# Altium project RK3128_BETA_V03_20151231.PrjPcb (part 1 of 3)
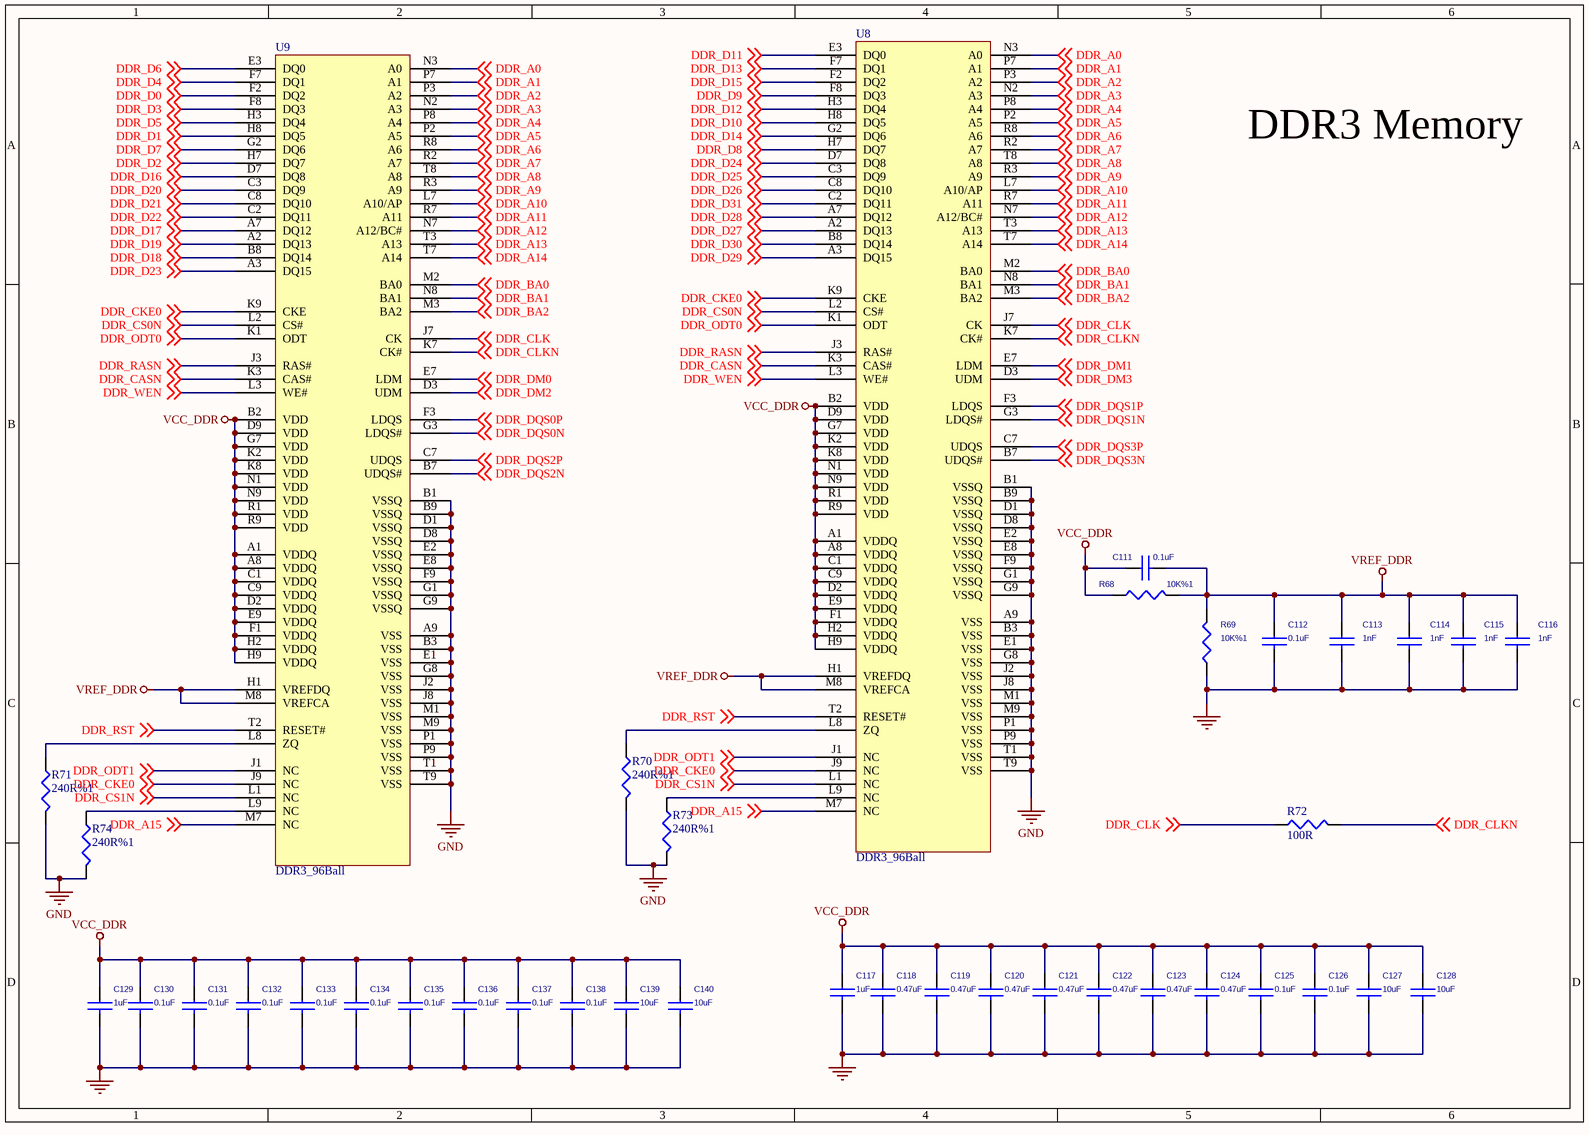
[diagram p0: Option_DDR3_96ball.SchDoc]
28 sheets, 530 parts. Net scope: global (net labels, ports and power ports of the same name join across sheets).
Sheets:
  Option_DDR3_96ball.SchDoc
  Option_Nand_Flash.SchDoc
  Option_LPDDR2-32_168_BGA134.SchDoc
  Option_lcd.SchDoc
  Option_PMIC_RK816.SchDoc
  Option_CTP.SchDoc
  Option_camera.SchDoc
  Option_Audio.SchDoc
  Option_key.SchDoc
  Option_AP6xxx.SchDoc
  Option_PMIC_RK808.SchDoc
  Option_Charger.SchDoc
  Option_LighterSensor.SchDoc
  Option_Humidity_Tempture_Sensor.SchDoc
  Option_MotionSensor.SchDoc
  Option_PMIC_RK818.SchDoc
  11_RK3128_CODEC_HDMI_DAC.SchDoc
  10_RK3128_misc.SchDoc
  09_Rk3128_lcd_cif.SchDoc
  08_RK3128_Flash_SDMMC.SchDoc
  07_RK3128_DDR.SchDoc
  06_RK3128_USB_ADC_Crystal.SchDoc
  05_RK3128_VDD.SchDoc
  04_Power_Diagram_rk816.SchDoc
  04_Power_Diagram.SchDoc
  03_Peripherals.SchDoc
  02_modify_note.SchDoc
  01_index.SchDoc

## Sheet Option_DDR3_96ball.SchDoc
size 297 x 209 mm

### Parts
C111  0.1uF  [C0402]
C112  0.1uF  [C0402]
C113  1nF  [C0402]
C114  1nF  [C0402]
C115  1nF  [C0402]
C116  1nF  [C0402]
C117  1uF  [C0402]
C118  0.47uF  [C0402]
C119  0.47uF  [C0402]
C120  0.47uF  [C0402]
C121  0.47uF  [C0402]
C122  0.47uF  [C0402]
C123  0.47uF  [C0402]
C124  0.47uF  [C0402]
C125  0.1uF  [C0402]
C126  0.1uF  [C0402]
C127  10uF  [C0805]
C128  10uF  [C0805]
C129  1uF  [C0402]
C130  0.1uF  [C0402]
C131  0.1uF  [C0402]
C132  0.1uF  [C0402]
C133  0.1uF  [C0402]
C134  0.1uF  [C0402]
C135  0.1uF  [C0402]
C136  0.1uF  [C0402]
C137  0.1uF  [C0402]
C138  0.1uF  [C0402]
C139  10uF  [C0805]
C140  10uF  [C0805]
R68  10K%1  [R0402]
R69  10K%1  [R0402]
R70  240R%1  [R0402]
R71  240R%1  [R0402]
R72  100R  [R0402]
R73  240R%1  [R0402]
R74  240R%1  [R0402]
U8  DDR3_96Ball
U9  DDR3_96Ball

### Nets
GND: C112.2 C113.2 C114.2 C115.2 C116.2 C117.2 C118.2 C119.2 C120.2 C121.2 C122.2 C123.2 C124.2 C125.2 C126.2 C127.2 C128.2 C129.2 C130.2 C131.2 C132.2 C133.2 C134.2 C135.2 C136.2 C137.2 C138.2 C139.2 C140.2 R69.1 R70.2 R71.2 R73.2 R74.2 U8.A9(VSS) U8.B1(VSSQ) U8.B3(VSS) U8.B9(VSSQ) U8.D1(VSSQ) U8.D8(VSSQ) U8.E1(VSS) U8.E2(VSSQ) U8.E8(VSSQ) U8.F9(VSSQ) U8.G1(VSSQ) U8.G8(VSS) U8.G9(VSSQ) U8.J2(VSS) U8.J8(VSS) U8.M1(VSS) U8.M9(VSS) U8.P1(VSS) U8.P9(VSS) U8.T1(VSS) U8.T9(VSS) U9.A9(VSS) U9.B1(VSSQ) U9.B3(VSS) U9.B9(VSSQ) U9.D1(VSSQ) U9.D8(VSSQ) U9.E1(VSS) U9.E2(VSSQ) U9.E8(VSSQ) U9.F9(VSSQ) U9.G1(VSSQ) U9.G8(VSS) U9.G9(VSSQ) U9.J2(VSS) U9.J8(VSS) U9.M1(VSS) U9.M9(VSS) U9.P1(VSS) U9.P9(VSS) U9.T1(VSS) U9.T9(VSS)
VCC_DDR: C111.1 C117.1 C118.1 C119.1 C120.1 C121.1 C122.1 C123.1 C124.1 C125.1 C126.1 C127.1 C128.1 C129.1 C130.1 C131.1 C132.1 C133.1 C134.1 C135.1 C136.1 C137.1 C138.1 C139.1 C140.1 R68.1 U8.A1(VDDQ) U8.A8(VDDQ) U8.B2(VDD) U8.C1(VDDQ) U8.C9(VDDQ) U8.D2(VDDQ) U8.D9(VDD) U8.E9(VDDQ) U8.F1(VDDQ) U8.G7(VDD) U8.H2(VDDQ) U8.H9(VDDQ) U8.K2(VDD) U8.K8(VDD) U8.N1(VDD) U8.N9(VDD) U8.R1(VDD) U8.R9(VDD) U9.A1(VDDQ) U9.A8(VDDQ) U9.B2(VDD) U9.C1(VDDQ) U9.C9(VDDQ) U9.D2(VDDQ) U9.D9(VDD) U9.E9(VDDQ) U9.F1(VDDQ) U9.G7(VDD) U9.H2(VDDQ) U9.H9(VDDQ) U9.K2(VDD) U9.K8(VDD) U9.N1(VDD) U9.N9(VDD) U9.R1(VDD) U9.R9(VDD)
VREF_DDR: C111.2 C112.1 C113.1 C114.1 C115.1 C116.1 R68.2 R69.2 U8.H1(VREFDQ) U8.M8(VREFCA) U9.H1(VREFDQ) U9.M8(VREFCA)
DDR_A0: U8.N3(A0) U9.N3(A0) ; off-sheet DDR_A0
DDR_A1: U8.P7(A1) U9.P7(A1) ; off-sheet DDR_A1
DDR_A2: U8.P3(A2) U9.P3(A2) ; off-sheet DDR_A2
DDR_A3: U8.N2(A3) U9.N2(A3) ; off-sheet DDR_A3
DDR_A4: U8.P8(A4) U9.P8(A4) ; off-sheet DDR_A4
DDR_A5: U8.P2(A5) U9.P2(A5) ; off-sheet DDR_A5
DDR_A6: U8.R8(A6) U9.R8(A6) ; off-sheet DDR_A6
DDR_A7: U8.R2(A7) U9.R2(A7) ; off-sheet DDR_A7
DDR_A8: U8.T8(A8) U9.T8(A8) ; off-sheet DDR_A8
DDR_A9: U8.R3(A9) U9.R3(A9) ; off-sheet DDR_A9
DDR_A10: U8.L7(A10/AP) U9.L7(A10/AP) ; off-sheet DDR_A10
DDR_A11: U8.R7(A11) U9.R7(A11) ; off-sheet DDR_A11
DDR_A12: U8.N7(A12/BC#) U9.N7(A12/BC#) ; off-sheet DDR_A12
DDR_A13: U8.T3(A13) U9.T3(A13) ; off-sheet DDR_A13
DDR_A14: U8.T7(A14) U9.T7(A14) ; off-sheet DDR_A14
DDR_A15: U8.M7(NC) U9.M7(NC) ; off-sheet DDR_A15
DDR_BA0: U8.M2(BA0) U9.M2(BA0) ; off-sheet DDR_BA0
DDR_BA1: U8.N8(BA1) U9.N8(BA1) ; off-sheet DDR_BA1
DDR_BA2: U8.M3(BA2) U9.M3(BA2) ; off-sheet DDR_BA2
DDR_CASN: U8.K3(CAS#) U9.K3(CAS#) ; off-sheet DDR_CASN
DDR_CKE0: U8.J9(NC) U8.K9(CKE) U9.J9(NC) U9.K9(CKE) ; off-sheet DDR_CKE0
DDR_CLK: R72.1 U8.J7(CK) U9.J7(CK) ; off-sheet DDR_CLK
DDR_CLKN: R72.2 U8.K7(CK#) U9.K7(CK#) ; off-sheet DDR_CLKN
DDR_CS0N: U8.L2(CS#) U9.L2(CS#) ; off-sheet DDR_CS0N
DDR_CS1N: U8.L1(NC) U9.L1(NC) ; off-sheet DDR_CS1N
DDR_D0: U9.F2(DQ2) ; off-sheet DDR_D0
DDR_D1: U9.H8(DQ5) ; off-sheet DDR_D1
DDR_D2: U9.H7(DQ7) ; off-sheet DDR_D2
DDR_D3: U9.F8(DQ3) ; off-sheet DDR_D3
DDR_D4: U9.F7(DQ1) ; off-sheet DDR_D4
DDR_D5: U9.H3(DQ4) ; off-sheet DDR_D5
DDR_D6: U9.E3(DQ0) ; off-sheet DDR_D6
DDR_D7: U9.G2(DQ6) ; off-sheet DDR_D7
DDR_D8: U8.H7(DQ7) ; off-sheet DDR_D8
DDR_D9: U8.F8(DQ3) ; off-sheet DDR_D9
DDR_D10: U8.H8(DQ5) ; off-sheet DDR_D10
DDR_D11: U8.E3(DQ0) ; off-sheet DDR_D11
DDR_D12: U8.H3(DQ4) ; off-sheet DDR_D12
DDR_D13: U8.F7(DQ1) ; off-sheet DDR_D13
DDR_D14: U8.G2(DQ6) ; off-sheet DDR_D14
DDR_D15: U8.F2(DQ2) ; off-sheet DDR_D15
DDR_D16: U9.D7(DQ8) ; off-sheet DDR_D16
DDR_D17: U9.A7(DQ12) ; off-sheet DDR_D17
DDR_D18: U9.B8(DQ14) ; off-sheet DDR_D18
DDR_D19: U9.A2(DQ13) ; off-sheet DDR_D19
DDR_D20: U9.C3(DQ9) ; off-sheet DDR_D20
DDR_D21: U9.C8(DQ10) ; off-sheet DDR_D21
DDR_D22: U9.C2(DQ11) ; off-sheet DDR_D22
DDR_D23: U9.A3(DQ15) ; off-sheet DDR_D23
DDR_D24: U8.D7(DQ8) ; off-sheet DDR_D24
DDR_D25: U8.C3(DQ9) ; off-sheet DDR_D25
DDR_D26: U8.C8(DQ10) ; off-sheet DDR_D26
DDR_D27: U8.A2(DQ13) ; off-sheet DDR_D27
DDR_D28: U8.A7(DQ12) ; off-sheet DDR_D28
DDR_D29: U8.A3(DQ15) ; off-sheet DDR_D29
DDR_D30: U8.B8(DQ14) ; off-sheet DDR_D30
DDR_D31: U8.C2(DQ11) ; off-sheet DDR_D31
DDR_DM0: U9.E7(LDM) ; off-sheet DDR_DM0
DDR_DM1: U8.E7(LDM) ; off-sheet DDR_DM1
DDR_DM2: U9.D3(UDM) ; off-sheet DDR_DM2
DDR_DM3: U8.D3(UDM) ; off-sheet DDR_DM3
DDR_DQS0N: U9.G3(LDQS#) ; off-sheet DDR_DQS0N
DDR_DQS0P: U9.F3(LDQS) ; off-sheet DDR_DQS0P
DDR_DQS1N: U8.G3(LDQS#) ; off-sheet DDR_DQS1N
DDR_DQS1P: U8.F3(LDQS) ; off-sheet DDR_DQS1P
DDR_DQS2N: U9.B7(UDQS#) ; off-sheet DDR_DQS2N
DDR_DQS2P: U9.C7(UDQS) ; off-sheet DDR_DQS2P
DDR_DQS3N: U8.B7(UDQS#) ; off-sheet DDR_DQS3N
DDR_DQS3P: U8.C7(UDQS) ; off-sheet DDR_DQS3P
DDR_ODT0: U8.K1(ODT) U9.K1(ODT) ; off-sheet DDR_ODT0
DDR_ODT1: U8.J1(NC) U9.J1(NC) ; off-sheet DDR_ODT1
DDR_RASN: U8.J3(RAS#) U9.J3(RAS#) ; off-sheet DDR_RASN
DDR_RST: U8.T2(RESET#) U9.T2(RESET#) ; off-sheet DDR_RST
DDR_WEN: U8.L3(WE#) U9.L3(WE#) ; off-sheet DDR_WEN
NetR70_1: R70.1 U8.L8(ZQ)
NetR71_1: R71.1 U9.L8(ZQ)
NetR73_1: R73.1 U8.L9(NC)
NetR74_1: R74.1 U9.L9(NC)

### Notes on the sheet
- DDR3 Memory

### Library data of the parts
C111-C116 = CAP NP_0
C117-C124 C129 C130 = CAP NP: RoHS CHIP CAP 1uF +10/-10% X5R
C125-C128 C131-C140 = CAP NP: RoHS CHIP CAP 0.1uF +10/-10% X7R
R68 R69 = RESISTOR_0: 贴片电阻
R70-R74 = RESISTOR

## Sheet Option_Nand_Flash.SchDoc
size 297 x 209 mm
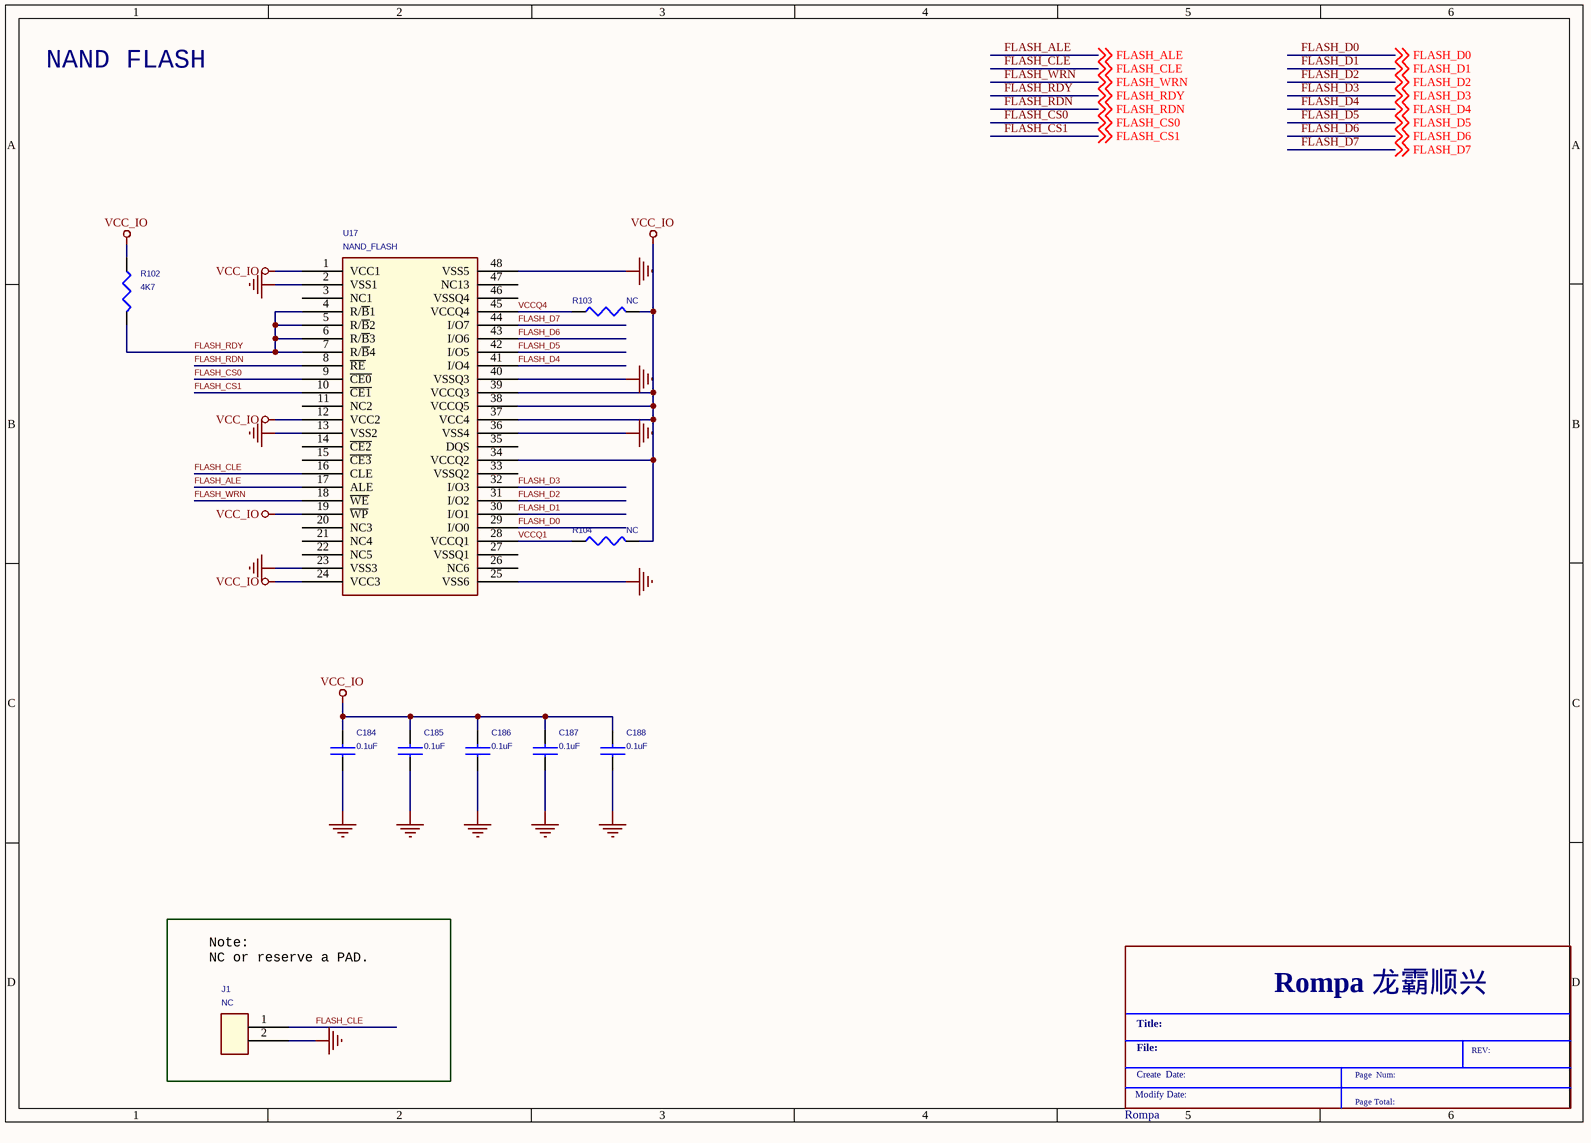
[diagram p1: Option_Nand_Flash.SchDoc]

### Parts
(Parts that share a designator on the sheet are numbered #1, #2 ... from top to bottom, then left to right.)
*#1  Rompa  (graphical)
C184  0.1uF  [C0402]
C185  0.1uF  [C0402]
C186  0.1uF  [C0402]
C187  0.1uF  [C0402]
C188  0.1uF  [C0402]
J1  NC  [R0603]
R102  4K7  [R0402]
R103  NC  [R0402]
R104  NC  [R0402]
U17  NAND_FLASH  [TSOP1-48]

### Nets
GND: C184.1 C185.1 C186.1 C187.1 C188.1 J1.2 U17.2(VSS1) U17.13(VSS2) U17.23(VSS3) U17.25(VSS6) U17.36(VSS4) U17.40(VSSQ3) U17.48(VSS5)
VCC_IO: C184.2 C185.2 C186.2 C187.2 C188.2 R102.1 R103.2 R104.2 U17.1(VCC1) U17.12(VCC2) U17.19(~{WP}) U17.24(VCC3) U17.34(VCCQ2) U17.37(VCC4) U17.38(VCCQ5) U17.39(VCCQ3)
FLASH_ALE: U17.17(ALE) ; off-sheet FLASH_ALE
FLASH_CLE: J1.1 U17.16(CLE) ; off-sheet FLASH_CLE
FLASH_CS0: U17.9(~{CE0}) ; off-sheet FLASH_CS0
FLASH_CS1: U17.10(~{CE1}) ; off-sheet FLASH_CS1
FLASH_D0: U17.29(I/O0) ; off-sheet FLASH_D0
FLASH_D1: U17.30(I/O1) ; off-sheet FLASH_D1
FLASH_D2: U17.31(I/O2) ; off-sheet FLASH_D2
FLASH_D3: U17.32(I/O3) ; off-sheet FLASH_D3
FLASH_D4: U17.41(I/O4) ; off-sheet FLASH_D4
FLASH_D5: U17.42(I/O5) ; off-sheet FLASH_D5
FLASH_D6: U17.43(I/O6) ; off-sheet FLASH_D6
FLASH_D7: U17.44(I/O7) ; off-sheet FLASH_D7
FLASH_RDN: U17.8(~{RE}) ; off-sheet FLASH_RDN
FLASH_RDY: R102.2 U17.4(R/~{B}1) U17.5(R/~{B}2) U17.6(R/~{B}3) U17.7(R/~{B}4) ; off-sheet FLASH_RDY
FLASH_WRN: U17.18(~{WE}) ; off-sheet FLASH_WRN
VCCQ1: R104.1 U17.28(VCCQ1)
VCCQ4: R103.1 U17.45(VCCQ4)

Not connected (* = marked no-connect by the designer): U17 3(NC1) 11(NC2) 14(~{CE2}) 15(~{CE3}) 20(NC3) 21(NC4) 22(NC5) 26(NC6) 27(VSSQ1) 33(VSSQ2) 35(DQS) 46(VSSQ4) 47(NC13)

### Notes on the sheet
- NAND FLASH
- (near J1) Note:
  NC or reserve a PAD.
- (in symbol Rompa) Rompa 龙霸顺兴; Title:; File:; REV:; Create  Date:; Page  Num:; Modify Date:; Page Total:

### Library data of the parts
C184-C188 = CAP NP: RoHS CHIP CAP 0.1uF +10/-10% X7R
J1 = CON2: TEST
R102-R104 = RES 1B: ROHS CHIP RES 4.7K 1/16W 5%
U17 = NANDFLASH_0: NAND Flash,2.7V,3.3V,3.6V,2G*8,N/A,-40℃~85℃,TSOP-48P

## Sheet Option_LPDDR2-32_168_BGA134.SchDoc
size 420 x 297 mm
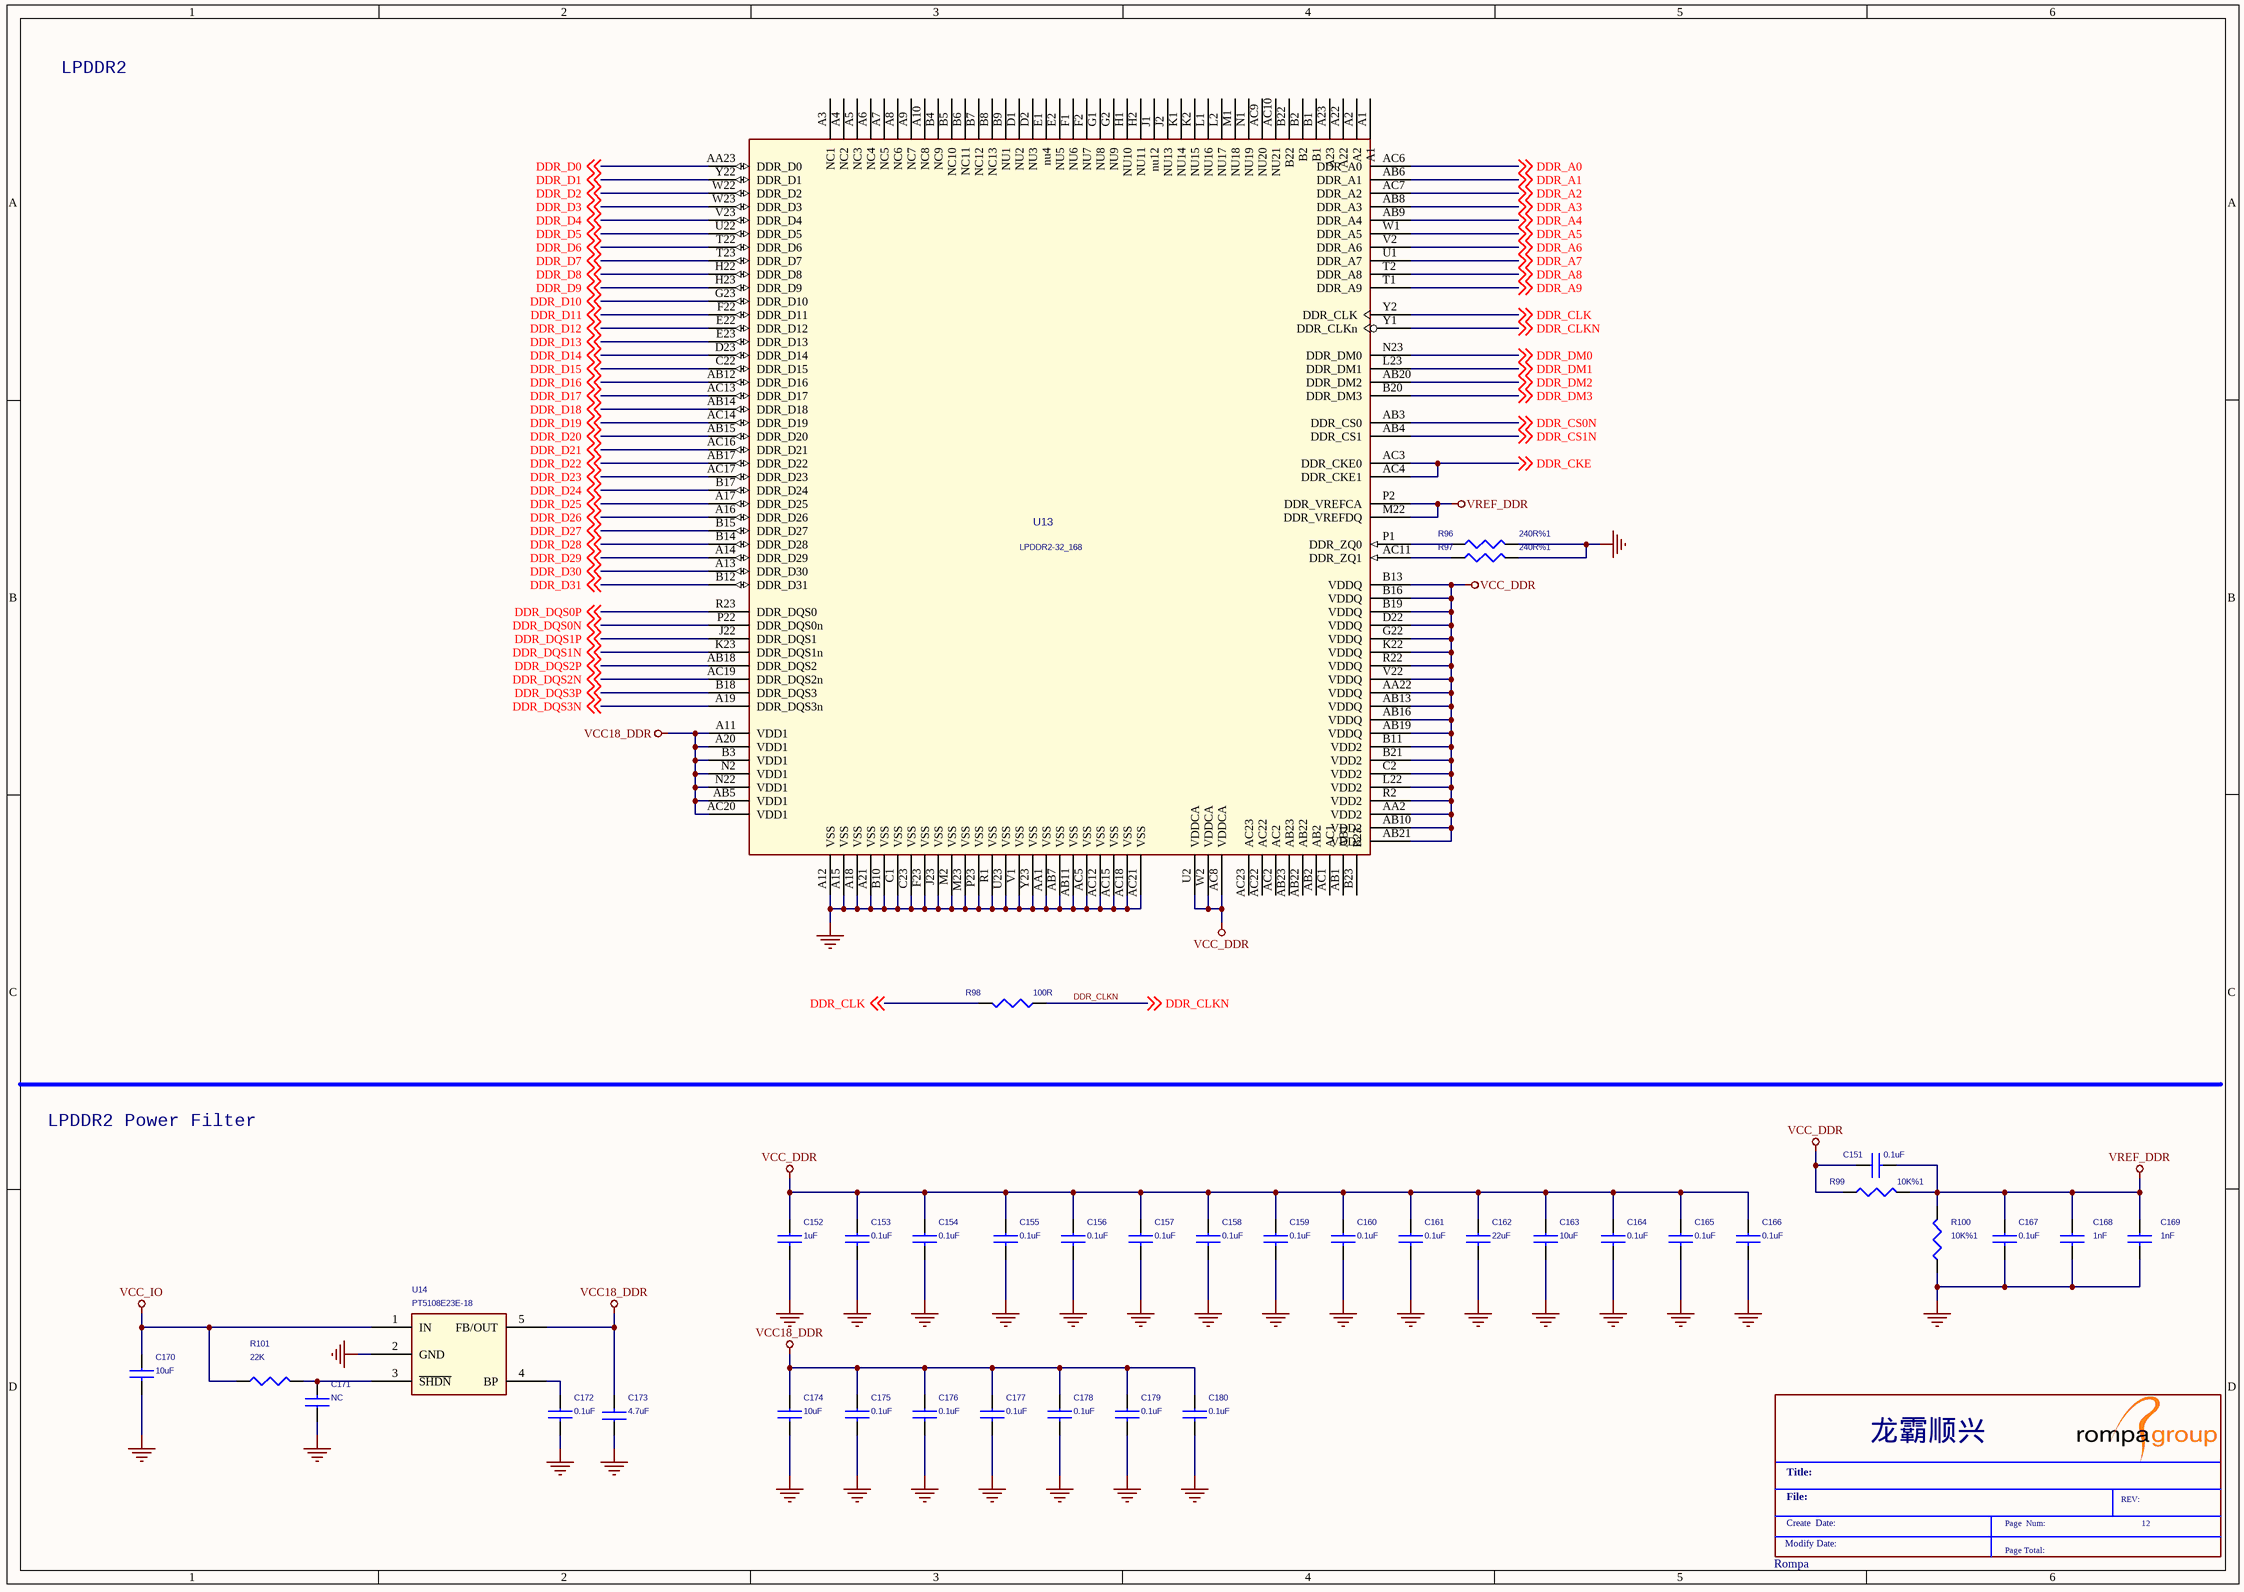
[diagram p2: Option_LPDDR2-32_168_BGA134.SchDoc]

### Parts
(Parts that share a designator on the sheet are numbered #1, #2 ... from top to bottom, then left to right.)
*#2  Rompa  Schematic Page Number: 12  (graphical)
C151  0.1uF  [C0402]
C152  1uF  [C0402]
C153  0.1uF  [C0402]
C154  0.1uF  [C0402]
C155  0.1uF  [C0402]
C156  0.1uF  [C0402]
C157  0.1uF  [C0402]
C158  0.1uF  [C0402]
C159  0.1uF  [C0402]
C160  0.1uF  [C0402]
C161  0.1uF  [C0402]
C162  22uF  [C0402]
C163  10uF  [C0402]
C164  0.1uF  [C0402]
C165  0.1uF  [C0402]
C166  0.1uF  [C0402]
C167  0.1uF  [C0402]
C168  1nF  [C0402]
C169  1nF  [C0402]
C170  10uF  [C0402]
C171  NC  [C0402]
C172  0.1uF  [C0402]
C173  4.7uF  [C0402]
C174  10uF  [C0402]
C175  0.1uF  [C0402]
C176  0.1uF  [C0402]
C177  0.1uF  [C0402]
C178  0.1uF  [C0402]
C179  0.1uF  [C0402]
C180  0.1uF  [C0402]
R96  240R%1  [R0402]
R97  240R%1  [R0402]
R98  100R  [R0402]
R99  10K%1  [R0402]
R100  10K%1  [R0402]
R101  22K  [R0402]
U13  LPDDR2-32_168  [BGA134]
U14  PT5108E23E-18  [SOT25]

### Nets
GND: C152.2 C153.2 C154.2 C155.2 C156.2 C157.2 C158.2 C159.2 C160.2 C161.2 C162.2 C163.2 C164.2 C165.2 C166.2 C167.2 C168.2 C169.2 C170.2 C171.1 C172.2 C173.1 C174.2 C175.2 C176.2 C177.2 C178.2 C179.2 C180.2 R96.2 R97.2 R100.1 U13.A12(VSS) U13.A15(VSS) U13.A18(VSS) U13.A21(VSS) U13.AA1(VSS) U13.AB7(VSS) U13.AB11(VSS) U13.AC5(VSS) U13.AC12(VSS) U13.AC15(VSS) U13.AC18(VSS) U13.AC21(VSS) U13.B10(VSS) U13.C1(VSS) U13.C23(VSS) U13.F23(VSS) U13.J23(VSS) U13.M2(VSS) U13.M23(VSS) U13.P23(VSS) U13.R1(VSS) U13.U23(VSS) U13.V1(VSS) U13.Y23(VSS) U14.2(GND)
VCC18_DDR: C173.2 C174.1 C175.1 C176.1 C177.1 C178.1 C179.1 C180.1 U13.A11(VDD1) U13.A20(VDD1) U13.AB5(VDD1) U13.AC20(VDD1) U13.B3(VDD1) U13.N2(VDD1) U13.N22(VDD1) U14.5(FB/OUT)
VCC_DDR: C151.1 C152.1 C153.1 C154.1 C155.1 C156.1 C157.1 C158.1 C159.1 C160.1 C161.1 C162.1 C163.1 C164.1 C165.1 C166.1 R99.1 U13.AA2(VDD2) U13.AA22(VDDQ) U13.AB10(VDD2) U13.AB13(VDDQ) U13.AB16(VDDQ) U13.AB19(VDDQ) U13.AB21(VDD2) U13.AC8(VDDCA) U13.B11(VDD2) U13.B13(VDDQ) U13.B16(VDDQ) U13.B19(VDDQ) U13.B21(VDD2) U13.C2(VDD2) U13.D22(VDDQ) U13.G22(VDDQ) U13.K22(VDDQ) U13.L22(VDD2) U13.R2(VDD2) U13.R22(VDDQ) U13.U2(VDDCA) U13.V22(VDDQ) U13.W2(VDDCA)
VCC_IO: C170.1 R101.1 U14.1(IN)
VREF_DDR: C151.2 C167.1 C168.1 C169.1 R99.2 R100.2 U13.M22(DDR_VREFDQ) U13.P2(DDR_VREFCA)
DDR_A0: U13.AC6(DDR_A0) ; off-sheet DDR_A0
DDR_A1: U13.AB6(DDR_A1) ; off-sheet DDR_A1
DDR_A2: U13.AC7(DDR_A2) ; off-sheet DDR_A2
DDR_A3: U13.AB8(DDR_A3) ; off-sheet DDR_A3
DDR_A4: U13.AB9(DDR_A4) ; off-sheet DDR_A4
DDR_A5: U13.W1(DDR_A5) ; off-sheet DDR_A5
DDR_A6: U13.V2(DDR_A6) ; off-sheet DDR_A6
DDR_A7: U13.U1(DDR_A7) ; off-sheet DDR_A7
DDR_A8: U13.T2(DDR_A8) ; off-sheet DDR_A8
DDR_A9: U13.T1(DDR_A9) ; off-sheet DDR_A9
DDR_CKE: U13.AC3(DDR_CKE0) U13.AC4(DDR_CKE1) ; off-sheet DDR_CKE
DDR_CLK: R98.2 U13.Y2(DDR_CLK) ; off-sheet DDR_CLK
DDR_CLKN: R98.1 U13.Y1(DDR_CLKn) ; off-sheet DDR_CLKN
DDR_CS0N: U13.AB3(DDR_CS0) ; off-sheet DDR_CS0N
DDR_CS1N: U13.AB4(DDR_CS1) ; off-sheet DDR_CS1N
DDR_D0: U13.AA23(DDR_D0) ; off-sheet DDR_D0
DDR_D1: U13.Y22(DDR_D1) ; off-sheet DDR_D1
DDR_D2: U13.W22(DDR_D2) ; off-sheet DDR_D2
DDR_D3: U13.W23(DDR_D3) ; off-sheet DDR_D3
DDR_D4: U13.V23(DDR_D4) ; off-sheet DDR_D4
DDR_D5: U13.U22(DDR_D5) ; off-sheet DDR_D5
DDR_D6: U13.T22(DDR_D6) ; off-sheet DDR_D6
DDR_D7: U13.T23(DDR_D7) ; off-sheet DDR_D7
DDR_D8: U13.H22(DDR_D8) ; off-sheet DDR_D8
DDR_D9: U13.H23(DDR_D9) ; off-sheet DDR_D9
DDR_D10: U13.G23(DDR_D10) ; off-sheet DDR_D10
DDR_D11: U13.F22(DDR_D11) ; off-sheet DDR_D11
DDR_D12: U13.E22(DDR_D12) ; off-sheet DDR_D12
DDR_D13: U13.E23(DDR_D13) ; off-sheet DDR_D13
DDR_D14: U13.D23(DDR_D14) ; off-sheet DDR_D14
DDR_D15: U13.C22(DDR_D15) ; off-sheet DDR_D15
DDR_D16: U13.AB12(DDR_D16) ; off-sheet DDR_D16
DDR_D17: U13.AC13(DDR_D17) ; off-sheet DDR_D17
DDR_D18: U13.AB14(DDR_D18) ; off-sheet DDR_D18
DDR_D19: U13.AC14(DDR_D19) ; off-sheet DDR_D19
DDR_D20: U13.AB15(DDR_D20) ; off-sheet DDR_D20
DDR_D21: U13.AC16(DDR_D21) ; off-sheet DDR_D21
DDR_D22: U13.AB17(DDR_D22) ; off-sheet DDR_D22
DDR_D23: U13.AC17(DDR_D23) ; off-sheet DDR_D23
DDR_D24: U13.B17(DDR_D24) ; off-sheet DDR_D24
DDR_D25: U13.A17(DDR_D25) ; off-sheet DDR_D25
DDR_D26: U13.A16(DDR_D26) ; off-sheet DDR_D26
DDR_D27: U13.B15(DDR_D27) ; off-sheet DDR_D27
DDR_D28: U13.B14(DDR_D28) ; off-sheet DDR_D28
DDR_D29: U13.A14(DDR_D29) ; off-sheet DDR_D29
DDR_D30: U13.A13(DDR_D30) ; off-sheet DDR_D30
DDR_D31: U13.B12(DDR_D31) ; off-sheet DDR_D31
DDR_DM0: U13.N23(DDR_DM0) ; off-sheet DDR_DM0
DDR_DM1: U13.L23(DDR_DM1) ; off-sheet DDR_DM1
DDR_DM2: U13.AB20(DDR_DM2) ; off-sheet DDR_DM2
DDR_DM3: U13.B20(DDR_DM3) ; off-sheet DDR_DM3
DDR_DQS0N: U13.P22(DDR_DQS0n) ; off-sheet DDR_DQS0N
DDR_DQS0P: U13.R23(DDR_DQS0) ; off-sheet DDR_DQS0P
DDR_DQS1N: U13.K23(DDR_DQS1n) ; off-sheet DDR_DQS1N
DDR_DQS1P: U13.J22(DDR_DQS1) ; off-sheet DDR_DQS1P
DDR_DQS2N: U13.AC19(DDR_DQS2n) ; off-sheet DDR_DQS2N
DDR_DQS2P: U13.AB18(DDR_DQS2) ; off-sheet DDR_DQS2P
DDR_DQS3N: U13.A19(DDR_DQS3n) ; off-sheet DDR_DQS3N
DDR_DQS3P: U13.B18(DDR_DQS3) ; off-sheet DDR_DQS3P
NetC171_2: C171.2 R101.2 U14.3(~{SHDN})
NetC172_1: C172.1 U14.4(BP)
NetR96_1: R96.1 U13.P1(DDR_ZQ0)
NetR97_1: R97.1 U13.AC11(DDR_ZQ1)

Not connected (* = marked no-connect by the designer): U13 A1 A2 A3(NC1) A4(NC2) A5(NC3) A6(NC4) A7(NC5) A8(NC6) A9(NC7) A10(NC8) A22 A23 AB1 AB2 AB22 AB23 AC1 AC2 AC9(NU20) AC10(NU21) AC22 AC23 B1 B2 B4(NC9) B5(NC10) B6(NC11) B7(NC12) B8(NC13) B9(NU1) B22 B23 D1(NU2) D2(NU3) E1(nu4) E2(NU5) F1(NU6) F2(NU7) G1(NU8) G2(NU9) H1(NU10) H2(NU11) J1(nu12) J2(NU13) K1(NU14) K2(NU15) L1(NU16) L2(NU17) M1(NU18) N1(NU19)

### Notes on the sheet
- LPDDR2
- LPDDR2 Power Filter
- (in symbol Rompa) 龙霸顺兴; Title:; File:; REV:; Create  Date:; Page  Num:; Modify Date:; Page Total:

### Library data of the parts
C151 C167-C169 = CAP NP_0
C152 C153 C174 = CAP NP: RoHS CHIP CAP 1uF +10/-10% X5R
C154-C166 C175-C180 = CAP NP: RoHS CHIP CAP 0.1uF +10/-10% X7R
C170 = CAP NP: CAP,MLCC,22uF,+/-10%,X5R,6.3V,SMD1206
C171 = CAP NP
C172 = CAP NP: CAP,MLCC,100nF,+/-10%,X7R,6.3V,SMD0402
C173 = CAP NP: CAP,MLCC,10uF,+/-10%,X5R,6.3V,SMD0805
R96 R97 R99 R100 = RESISTOR_0: 贴片电阻
R98 = RESISTOR: NC/ROHS CHIP RES 100R 1/16W 5%
R101 = RES 1B
U13 = LPDDR2-32_2
U14 = DS8008_4: LDO,PT5108E23E-18,VINmax=5.5V,Vout=1.8V,+/-2%,500mA,SOT-23-5

## Sheet Option_lcd.SchDoc
size 297 x 209 mm
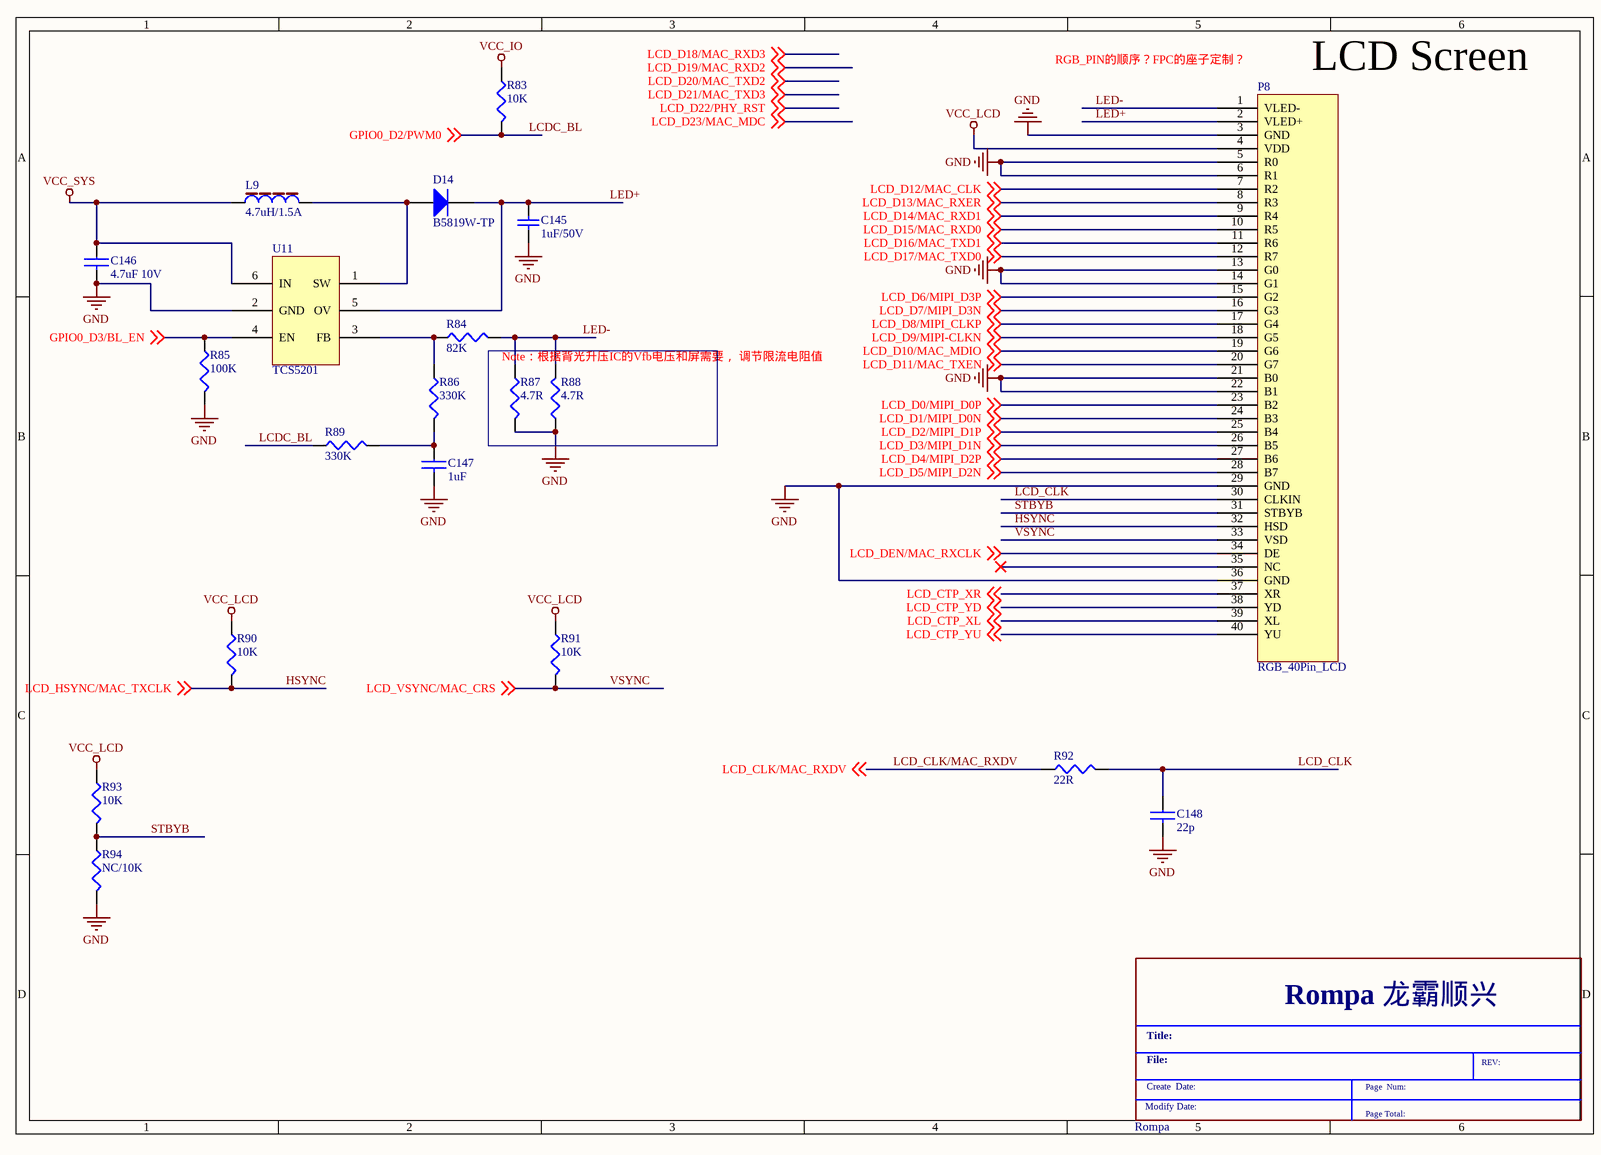
[diagram p3: Option_lcd.SchDoc]

### Parts
(Parts that share a designator on the sheet are numbered #1, #2 ... from top to bottom, then left to right.)
*#3  Rompa  (graphical)
C145  1uF/50V  [2012[0805]]
C146  4.7uF 10V  [C0603]
C147  1uF  [C0805]
C148  22p  [C0402]
D14  B5819W-TP
L9  4.7uH/1.5A
P8  RGB_40Pin_LCD
R83  10K  [R0402]
R84  82K  [R0402]
R85  100K  [R0402]
R86  330K  [R0402]
R87  4.7R  [1608[0603]]
R88  4.7R  [1608[0603]]
R89  330K  [R0402]
R90  10K  [R0402]
R91  10K  [R0402]
R92  22R  [R0402]
R93  10K  [R0402]
R94  NC/10K  [R0402]
U11  TCS5201

### Blocks framed on the sheet
Note：根据背光升压IC的Vfb电压和屏需要， 调节限流电阻值: R87 R88

### Nets
GND: C145.1 C146.2 C147.2 C148.2 P8.3(GND) P8.5(R0) P8.6(R1) P8.13(G0) P8.14(G1) P8.21(B0) P8.22(B1) P8.29(GND) P8.36(GND) R85.2 R87.2 R88.1 R94.2 U11.2(GND)
VCC_IO: R83.1
VCC_LCD: P8.4(VDD) R90.1 R91.1 R93.1
VCC_SYS: C146.1 L9.1 U11.6(IN)
GPIO0_D3/BL_EN: R85.1 U11.4(EN) ; off-sheet GPIO0_D3/BL_EN
HSYNC: P8.32(HSD) R90.2 ; off-sheet LCD_HSYNC/MAC_TXCLK  [also labelled LCD_HSYNC/MAC_TXCLK]
LCD_CLK: C148.1 P8.30(CLKIN) R92.2
LCD_CLK/MAC_RXDV: R92.1 ; off-sheet LCD_CLK/MAC_RXDV
LCD_CTP_XL: P8.39(XL) ; off-sheet LCD_CTP_XL
LCD_CTP_XR: P8.37(XR) ; off-sheet LCD_CTP_XR
LCD_CTP_YD: P8.38(YD) ; off-sheet LCD_CTP_YD
LCD_CTP_YU: P8.40(YU) ; off-sheet LCD_CTP_YU
LCD_D0/MIPI_D0P: P8.23(B2) ; off-sheet LCD_D0/MIPI_D0P
LCD_D1/MIPI_D0N: P8.24(B3) ; off-sheet LCD_D1/MIPI_D0N
LCD_D2/MIPI_D1P: P8.25(B4) ; off-sheet LCD_D2/MIPI_D1P
LCD_D3/MIPI_D1N: P8.26(B5) ; off-sheet LCD_D3/MIPI_D1N
LCD_D4/MIPI_D2P: P8.27(B6) ; off-sheet LCD_D4/MIPI_D2P
LCD_D5/MIPI_D2N: P8.28(B7) ; off-sheet LCD_D5/MIPI_D2N
LCD_D6/MIPI_D3P: P8.15(G2) ; off-sheet LCD_D6/MIPI_D3P
LCD_D7/MIPI_D3N: P8.16(G3) ; off-sheet LCD_D7/MIPI_D3N
LCD_D8/MIPI_CLKP: P8.17(G4) ; off-sheet LCD_D8/MIPI_CLKP
LCD_D9/MIPI-CLKN: P8.18(G5) ; off-sheet LCD_D9/MIPI-CLKN
LCD_D10/MAC_MDIO: P8.19(G6) ; off-sheet LCD_D10/MAC_MDIO
LCD_D11/MAC_TXEN: P8.20(G7) ; off-sheet LCD_D11/MAC_TXEN
LCD_D12/MAC_CLK: P8.7(R2) ; off-sheet LCD_D12/MAC_CLK
LCD_D13/MAC_RXER: P8.8(R3) ; off-sheet LCD_D13/MAC_RXER
LCD_D14/MAC_RXD1: P8.9(R4) ; off-sheet LCD_D14/MAC_RXD1
LCD_D15/MAC_RXD0: P8.10(R5) ; off-sheet LCD_D15/MAC_RXD0
LCD_D16/MAC_TXD1: P8.11(R6) ; off-sheet LCD_D16/MAC_TXD1
LCD_D17/MAC_TXD0: P8.12(R7) ; off-sheet LCD_D17/MAC_TXD0
LCD_D18/MAC_RXD3: off-sheet LCD_D19/MAC_RXD2, off-sheet LCD_D18/MAC_RXD3  [also labelled LCD_D19/MAC_RXD2]  [project net Camera_I2C_SCL]
LCD_DEN/MAC_RXCLK: P8.34(DE) ; off-sheet LCD_DEN/MAC_RXCLK
LCDC_BL: R83.2 R89.1 ; off-sheet GPIO0_D2/PWM0  [also labelled GPIO0_D2/PWM0]
LED+: C145.2 D14.2(K) P8.2(VLED+) U11.5(OV)
LED-: P8.1(VLED-) R84.2 R87.1 R88.2
STBYB: P8.31(STBYB) R93.2 R94.1
VSYNC: P8.33(VSD) R91.2 ; off-sheet LCD_VSYNC/MAC_CRS  [also labelled LCD_VSYNC/MAC_CRS]
NetC147_1: C147.1 R86.2 R89.2
NetD14_1: D14.1(A) L9.2 U11.1(SW)
NetR84_1: R84.1 R86.1 U11.3(FB)

Not connected (* = marked no-connect by the designer): P8 35(NC)*

### Notes on the sheet
- RGB_PIN的顺序？FPC的座子定制？
- LCD Screen
- (in symbol Rompa) Rompa 龙霸顺兴; Title:; File:; REV:; Create  Date:; Page  Num:; Modify Date:; Page Total:

### Library data of the parts
C145 = Cap: 1uF/50V,; Published: 8-Jun-2000; LatestRevisionDate: 17-Jul-2002; LatestRevisionNote: Re-released for DXP Platform.; PackageReference: RAD-0.3; Publisher: Altium Limited
C146 = CAP NP_Dup1
C147 C148 = CAP NP
D14 = Diode: Micro Commercial Co ,  SOD-123; Published: 8-Jun-2000; LatestRevisionDate: 17-Jul-2002; LatestRevisionNote: Re-released for DXP Platform.; PackageDocument: Sep-1996; PackageReference: SMC; Publisher: Altium Limited; Code_JEDEC: DO-214-AB
L9 = INDUCTOR_2: 4.7uH/1.5A , IND_4x4
P8 = RGB_40Pin_LCD: FPC的规格：0.5mm间距， 40PING，Pitch2.0mm, 翻盖式 下接
R83-R94 = RESISTOR
U11 = TCS5201: LED升压模块, STO26

## Sheet Option_PMIC_RK816.SchDoc
size 297 x 209 mm
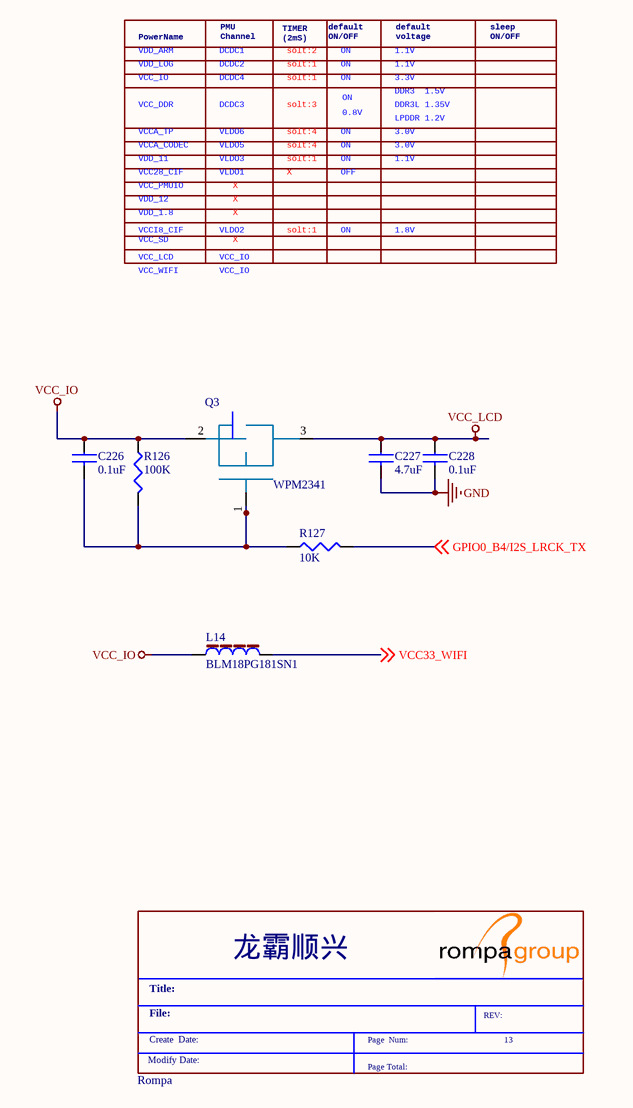
[diagram p4: Option_PMIC_RK816.SchDoc]

### Parts
(Parts that share a designator on the sheet are numbered #1, #2 ... from top to bottom, then left to right.)
*#4  Rompa  Schematic Page Number: 13  (graphical)
C226  0.1uF  [C0402]
C227  4.7uF  [C0402]
C228  0.1uF  [C0402]
L14  BLM18PG181SN1  [L0603]
Q3  WPM2341  [SOT23]
R126  100K  [R0402]
R127  10K  [R0402]

### Nets
GND: C227.2 C228.2
VCC_IO: C226.1 L14.1 R126.1
VCC_LCD: C227.1 C228.1
GPIO0_B4/I2S_LRCK_TX: R127.2 ; off-sheet GPIO0_B4/I2S_LRCK_TX
VCC33_WIFI: L14.2 ; off-sheet VCC33_WIFI  [project net VCCIO_WL]
NetC226_2: C226.2 Q3.1 R126.2 R127.1

Not connected (* = marked no-connect by the designer): Q3 2 3

### Notes on the sheet
- VDD_ARM
- VCC_IO
- PowerName
- VDD_LOG
- DCDC4
- PMU
  Channel
- DCDC2
- DCDC1
- TIMER
  (2mS)
- solt:1
- solt:2
- default
  ON/OFF
- ON
- default
  voltage
- 1.1V
- DDR3  1.5V
- 3.3V
- sleep
  ON/OFF
- VCC_DDR
- VDD_11
- VCCA_TP
- VCCA_CODEC
- DCDC3
- VLDO3
- VLDO5
- VLDO6
- solt:3
- solt:4
- 0.8V
- 3.0V
- LPDDR 1.2V
- DDR3L 1.35V
- VCCI8_CIF
- VCC28_CIF
- VCC_PMUIO
- VDD_12
- VDD_1.8
- VLDO1
- VLDO2
- X
- OFF
- 1.8V
- VCC_LCD
- VCC_SD
- VCC_WIFI
- (in symbol Rompa) 龙霸顺兴; Title:; File:; REV:; Create  Date:; Page  Num:; Modify Date:; Page Total:

### Library data of the parts
C226-C228 = CAP NP
L14 = INDUCTOR_2
R126 R127 = RESISTOR

## Sheet Option_CTP.SchDoc
size 297 x 209 mm
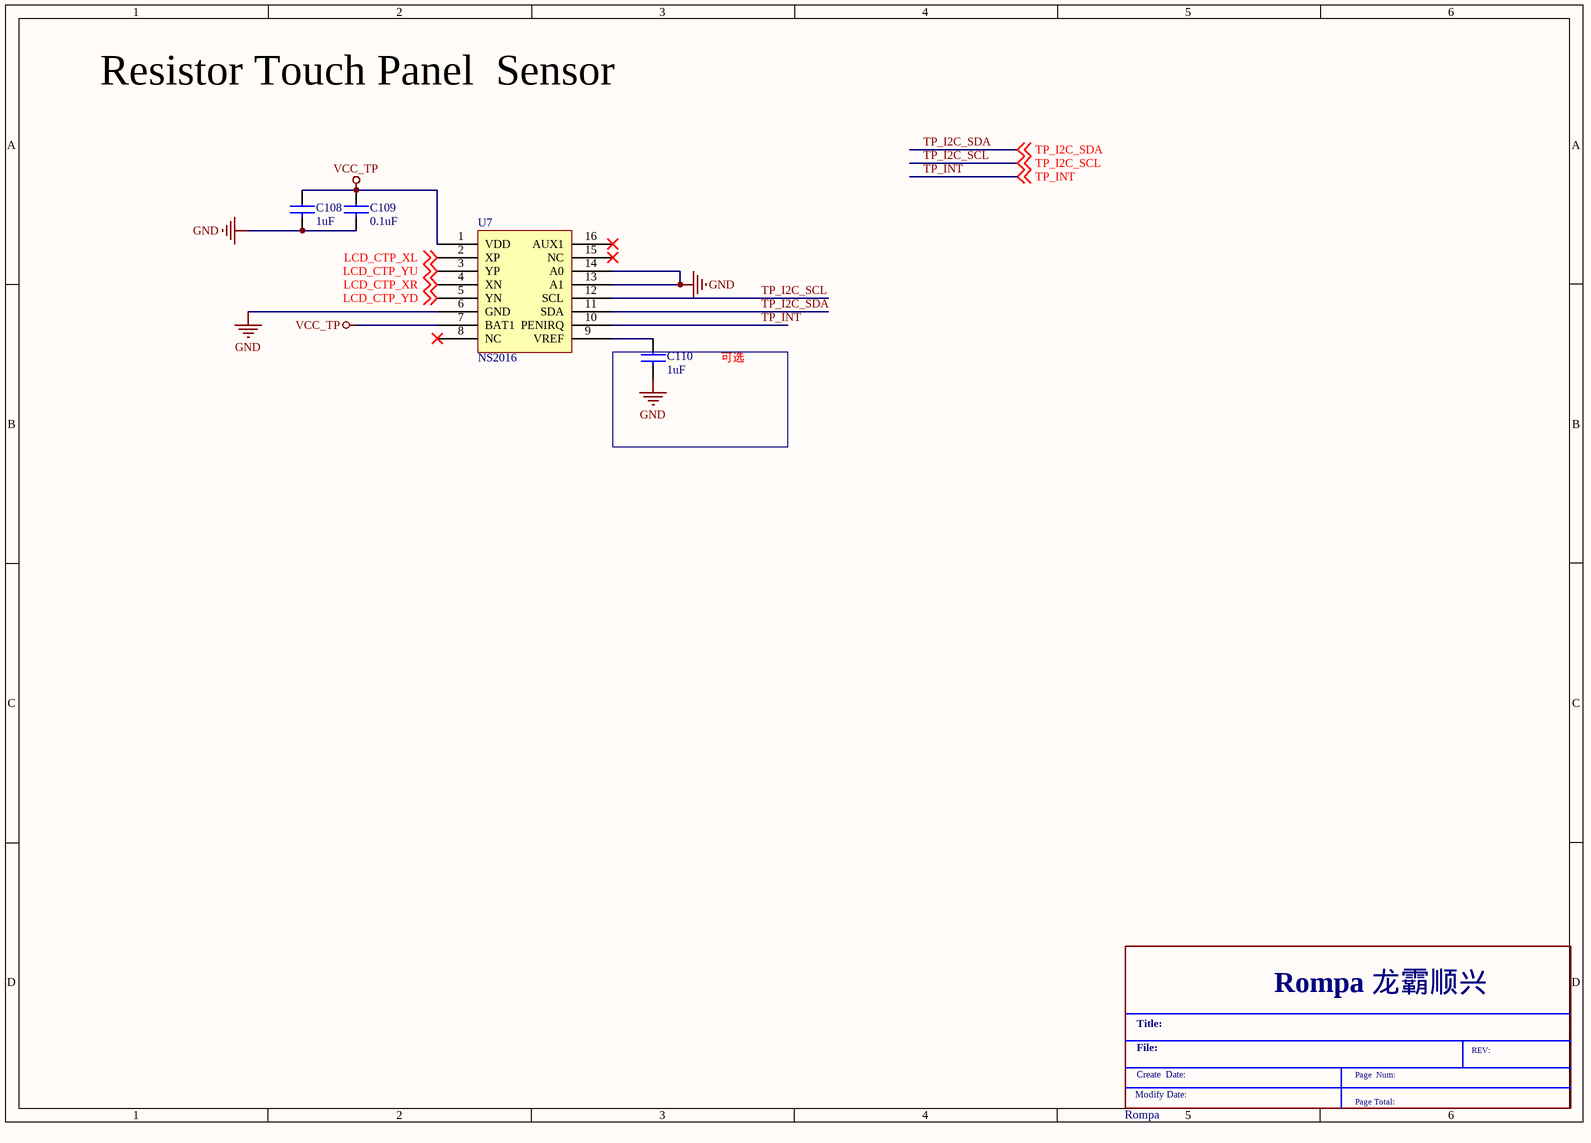
[diagram p5: Option_CTP.SchDoc]

### Parts
(Parts that share a designator on the sheet are numbered #1, #2 ... from top to bottom, then left to right.)
*#5  Rompa  (graphical)
C108  1uF  [C0402]
C109  0.1uF  [C0402]
C110  1uF  [C0402]
U7  NS2016  [SSOP16]

### Blocks framed on the sheet
可选: C110

### Nets
GND: C108.2 C109.2 C110.2 U7.6(GND) U7.13(A1) U7.14(A0)
VCC_TP: C108.1 C109.1 U7.1(VDD) U7.7(BAT1)
LCD_CTP_XL: U7.2(XP) ; off-sheet LCD_CTP_XL
LCD_CTP_XR: U7.4(XN) ; off-sheet LCD_CTP_XR
LCD_CTP_YD: U7.5(YN) ; off-sheet LCD_CTP_YD
LCD_CTP_YU: U7.3(YP) ; off-sheet LCD_CTP_YU
TP_I2C_SCL: U7.11(SDA) U7.12(SCL) ; off-sheet TP_I2C_SDA, off-sheet TP_I2C_SCL  [also labelled TP_I2C_SDA]  [project net Camera_I2C_SCL]
TP_INT: U7.10(PENIRQ) ; off-sheet TP_INT
NetC110_1: C110.1 U7.9(VREF)

Not connected (* = marked no-connect by the designer): U7 8(NC)* 15(NC)* 16(AUX1)*

### Notes on the sheet
- Resistor Touch Panel  Sensor
- (in symbol Rompa) Rompa 龙霸顺兴; Title:; File:; REV:; Create  Date:; Page  Num:; Modify Date:; Page Total:

### Library data of the parts
C108-C110 = CAP NP
U7 = NS2016: TSSOP-16

## Sheet Option_camera.SchDoc
size 297 x 209 mm
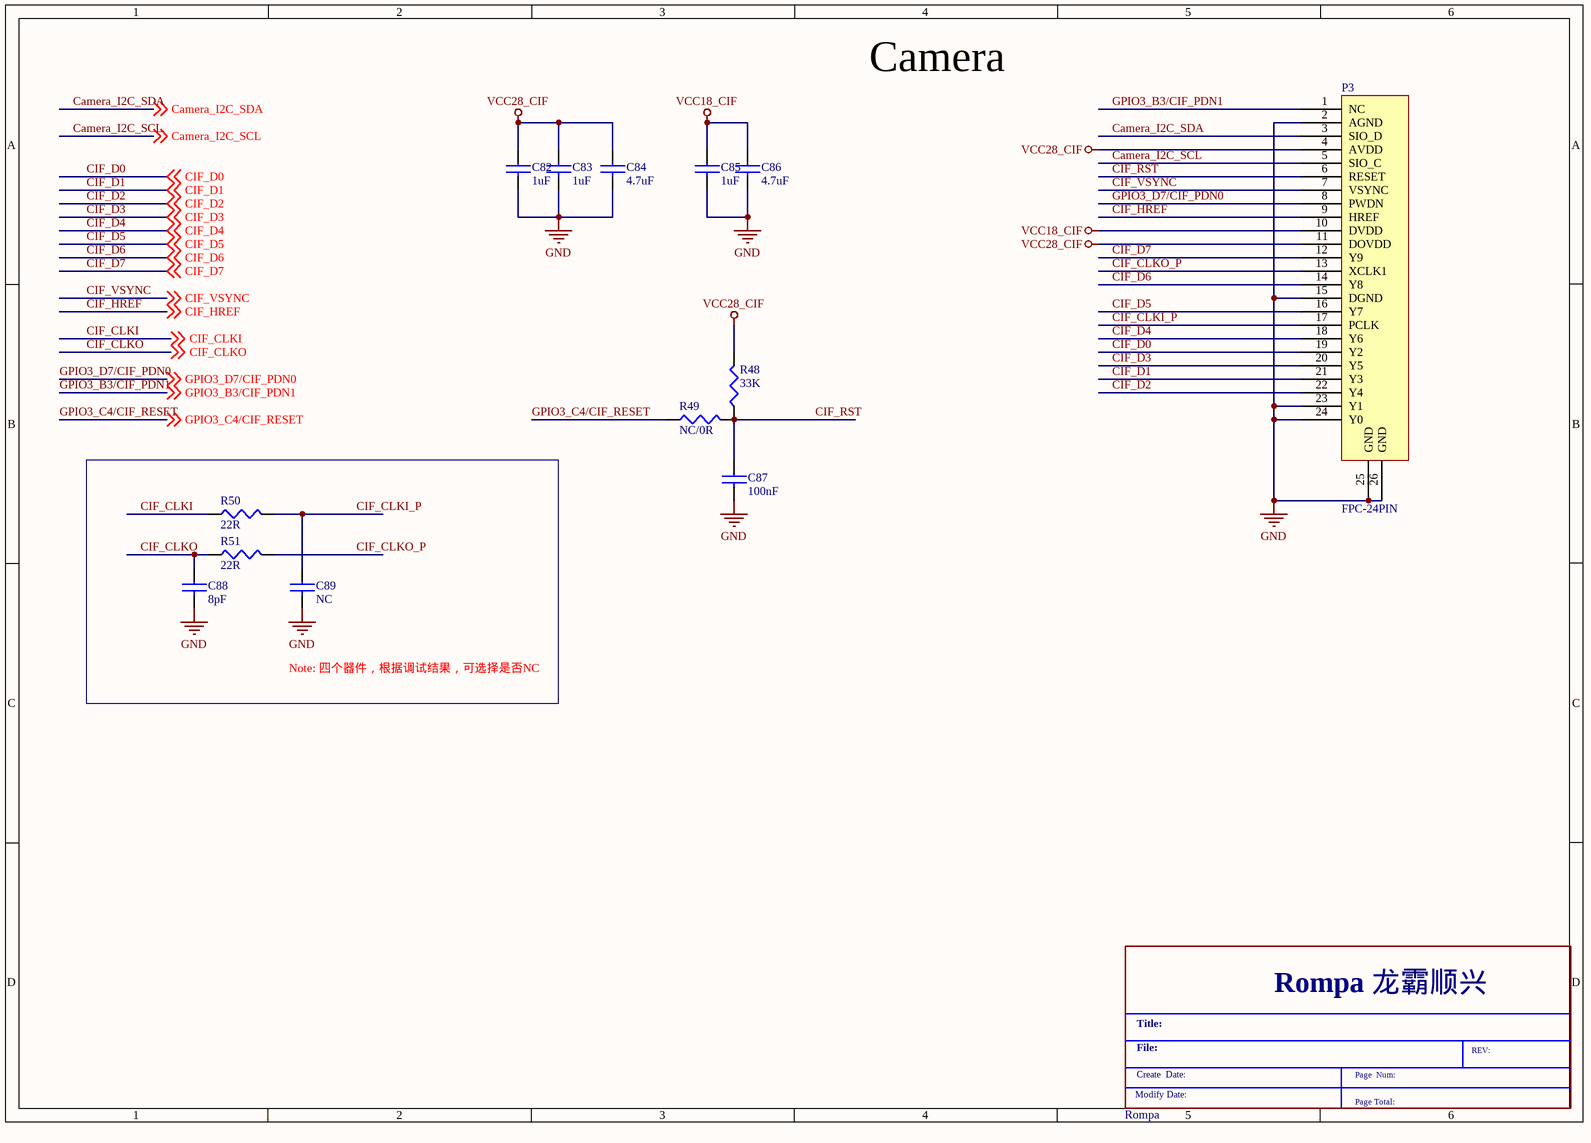
[diagram p6: Option_camera.SchDoc]

### Parts
(Parts that share a designator on the sheet are numbered #1, #2 ... from top to bottom, then left to right.)
*#6  Rompa  (graphical)
C82  1uF  [C0402]
C83  1uF  [C0402]
C84  4.7uF  [C0603]
C85  1uF  [C0402]
C86  4.7uF  [C0603]
C87  100nF  [C0402]
C88  8pF  [C0402]
C89  NC  [C0402]
P3  FPC-24PIN
R48  33K  [R0402]
R49  NC/0R  [R0402]
R50  22R  [R0402]
R51  22R  [R0402]

### Blocks framed on the sheet
Note: 四个器件，根据调试结果，可选择是否NC: C88 C89 R50 R51

### Nets
GND: C82.2 C83.2 C84.2 C85.2 C86.2 C87.2 C88.2 C89.2 P3.2(AGND) P3.15(DGND) P3.23(Y1) P3.24(Y0) P3.25(GND) P3.26(GND)
VCC18_CIF: C85.1 C86.1 P3.10(DVDD)
VCC28_CIF: C82.1 C83.1 C84.1 P3.4(AVDD) P3.11(DOVDD) R48.2
Camera_I2C_SCL: P3.3(SIO_D) P3.5(SIO_C) ; off-sheet Camera_I2C_SDA, off-sheet Camera_I2C_SCL  [also labelled Camera_I2C_SDA]
CIF_CLKI: R50.1 ; off-sheet CIF_CLKI
CIF_CLKI_P: C89.1 P3.17(PCLK) R50.2
CIF_CLKO: C88.1 R51.1 ; off-sheet CIF_CLKO
CIF_CLKO_P: P3.13(XCLK1) R51.2
CIF_D0: P3.19(Y2) ; off-sheet CIF_D0
CIF_D1: P3.21(Y3) ; off-sheet CIF_D1
CIF_D2: P3.22(Y4) ; off-sheet CIF_D2
CIF_D3: P3.20(Y5) ; off-sheet CIF_D3
CIF_D4: P3.18(Y6) ; off-sheet CIF_D4
CIF_D5: P3.16(Y7) ; off-sheet CIF_D5
CIF_D6: P3.14(Y8) ; off-sheet CIF_D6
CIF_D7: P3.12(Y9) ; off-sheet CIF_D7
CIF_HREF: P3.9(HREF) ; off-sheet CIF_HREF
CIF_RST: C87.1 P3.6(RESET) R48.1 R49.2
CIF_VSYNC: P3.7(VSYNC) ; off-sheet CIF_VSYNC
GPIO3_B3/CIF_PDN1: P3.1(NC) ; off-sheet GPIO3_B3/CIF_PDN1
GPIO3_C4/CIF_RESET: R49.1 ; off-sheet GPIO3_C4/CIF_RESET
GPIO3_D7/CIF_PDN0: P3.8(PWDN) ; off-sheet GPIO3_D7/CIF_PDN0

### Notes on the sheet
- Camera
- (in symbol Rompa) Rompa 龙霸顺兴; Title:; File:; REV:; Create  Date:; Page  Num:; Modify Date:; Page Total:

### Library data of the parts
C82 C83 C85 C87 C89 = CAP NP
C84 C86 = CAP NP_Dup1
C88 = CAP NP: 50V
P3 = FPC_24PIN: cif 24pin footprint
R48-R51 = RESISTOR

## Sheet Option_Audio.SchDoc
size 297 x 209 mm
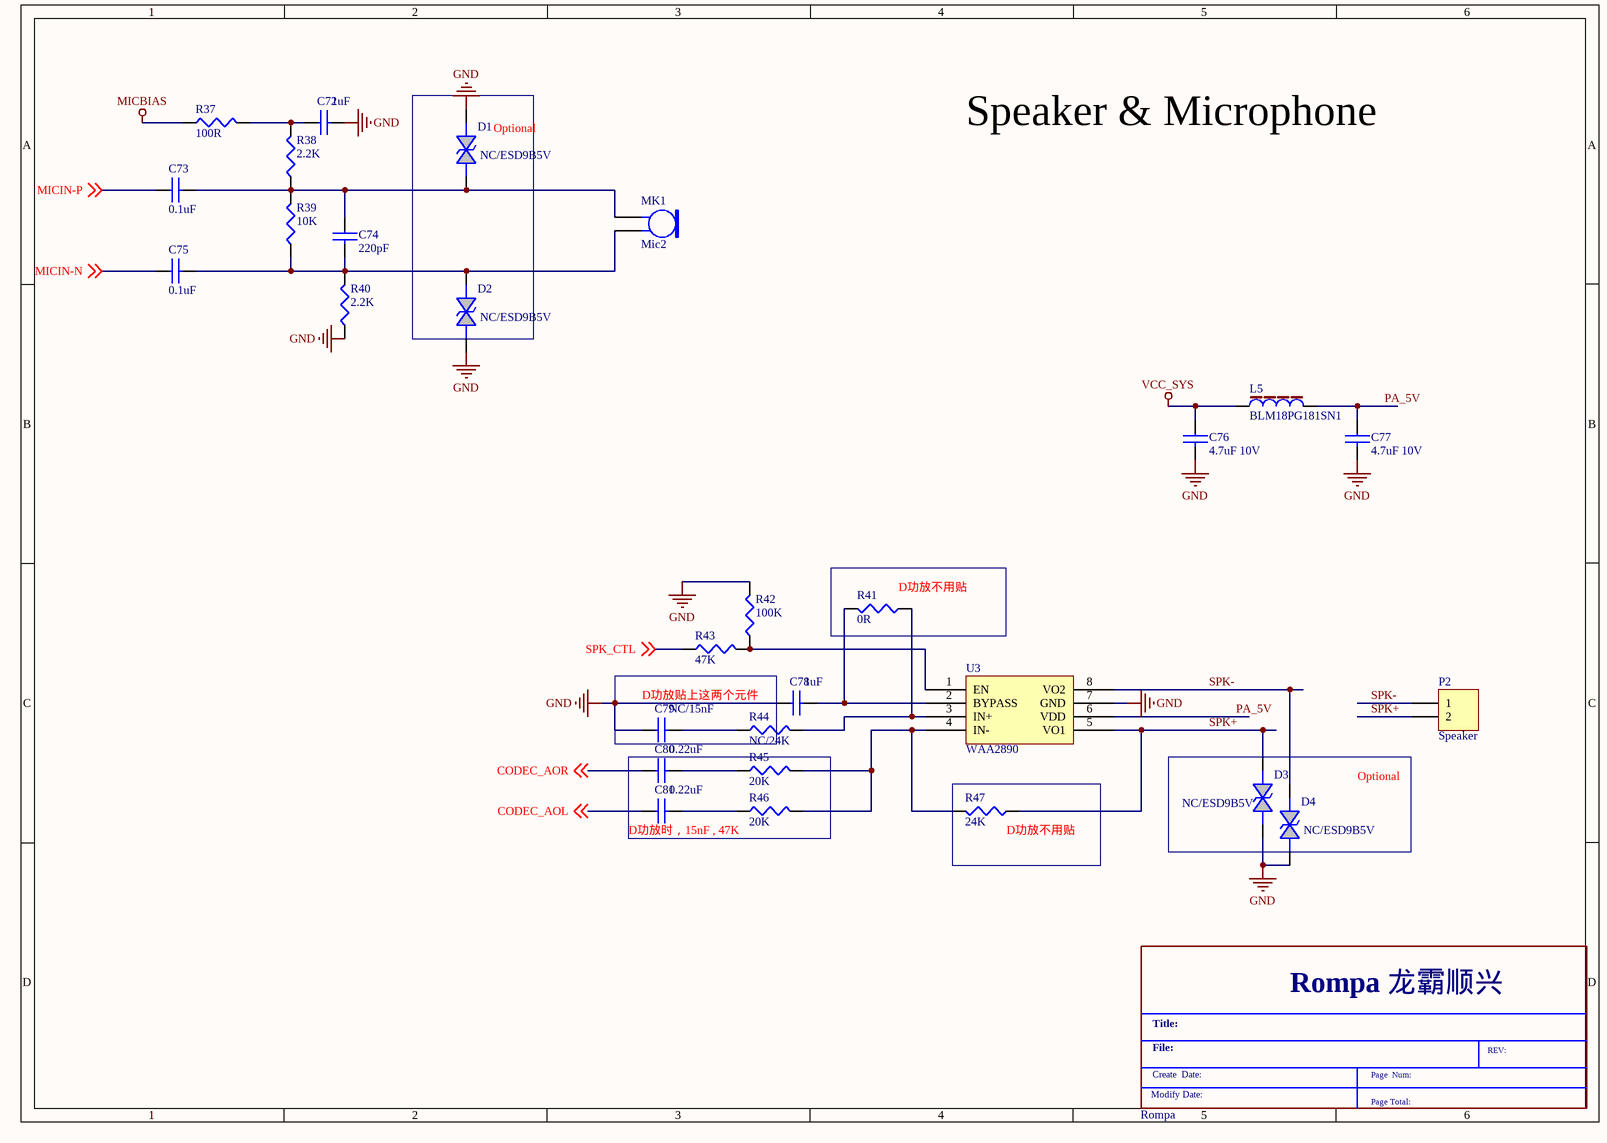
[diagram p7: Option_Audio.SchDoc]

### Parts
(Parts that share a designator on the sheet are numbered #1, #2 ... from top to bottom, then left to right.)
*#7  Rompa  (graphical)
C72  1uF  [C0402]
C73  0.1uF  [C0402]
C74  220pF  [C0402]
C75  0.1uF  [C0402]
C76  4.7uF 10V  [C0603]
C77  4.7uF 10V  [C0603]
C78  1uF  [C0402]
C79  NC/15nF  [C0402]
C80  0.22uF  [C0805]
C81  0.22uF  [C0805]
D1  NC/ESD9B5V
D2  NC/ESD9B5V
D3  NC/ESD9B5V
D4  NC/ESD9B5V
L5  BLM18PG181SN1  [L0603]
MK1  Mic2  [PIN2]
P2  Speaker  [HDR1X2]
R37  100R  [R0402]
R38  2.2K  [R0402]
R39  10K  [R0402]
R40  2.2K  [R0402]
R41  0R  [R0402]
R42  100K  [R0402]
R43  47K  [R0402]
R44  NC/24K  [R0402]
R45  20K  [1608[0603]]
R46  20K  [1608[0603]]
R47  24K  [R0402]
U3  WAA2890

### Blocks framed on the sheet
Optional: D1 D2
D功放不用贴: R41
D功放贴上这两个元件: C79 R44
D功放时，15nF , 47K: C80 C81 R45 R46
Optional: D3 D4
D功放不用贴: R47

### Nets
GND: C72.2 C76.2 C77.2 C78.1 C79.1 D1.2 D2.1 D3.1 D4.1 R40.1 R42.2 U3.7(GND)
MICBIAS: R37.1
VCC_SYS: C76.1 L5.1
CODEC_AOL: C81.1 ; off-sheet CODEC_AOL
CODEC_AOR: C80.1 ; off-sheet CODEC_AOR
MICIN-N: C75.1 ; off-sheet MICIN-N
MICIN-P: C73.1 ; off-sheet MICIN-P
PA_5V: C77.1 L5.2 U3.6(VDD)
SPK+: D3.2 P2.2 R47.1 U3.5(VO1)
SPK-: D4.2 P2.1 U3.8(VO2)
SPK_CTL: R43.1 ; off-sheet SPK_CTL
NetC72_1: C72.1 R37.2 R38.2
NetC73_2: C73.2 C74.1 D1.1 MK1.1 R38.1 R39.2
NetC74_2: C74.2 C75.2 D2.2 MK1.2 R39.1 R40.2
NetC78_2: C78.2 R41.2 U3.2(BYPASS)
NetC79_2: C79.2 R44.1
NetC80_2: C80.2 R45.1
NetC81_2: C81.2 R46.1
NetR41_1: R41.1 R44.2 U3.3(IN+)
NetR42_1: R42.1 R43.2 U3.1(EN)
NetR45_2: R45.2 R46.2 R47.2 U3.4(IN-)

### Notes on the sheet
- Speaker & Microphone
- (in symbol Rompa) Rompa 龙霸顺兴; Title:; File:; REV:; Create  Date:; Page  Num:; Modify Date:; Page Total:

### Library data of the parts
C72-C75 C78 = CAP NP
C76 C77 = CAP NP_Dup1
C79 = CAP NP: %10 10V
C80 C81 = CAP NP: 10V %10
D1-D4 = DIODE BI-DIR TRIG: FP:E0402N
L5 = INDUCTOR_2
MK1 = Mic2: Microphone; Published: 24-Mar-1999; LatestRevisionDate: 17-Jul-2002; LatestRevisionNote: Re-released for DXP Platform.; PackageReference: PIN2; Publisher: Altium Limited
P2 = Header 2: Header, 2-Pin; LatestRevisionDate: 17-Jul-2002; LatestRevisionNote: Re-released for DXP Platform.; Publisher: Altium Limited
R37-R43 R47 = RESISTOR
R44-R46 = RESISTOR: 1/16W %5
U3 = WAA2890: MSOP8

## Sheet Option_key.SchDoc
size 297 x 209 mm
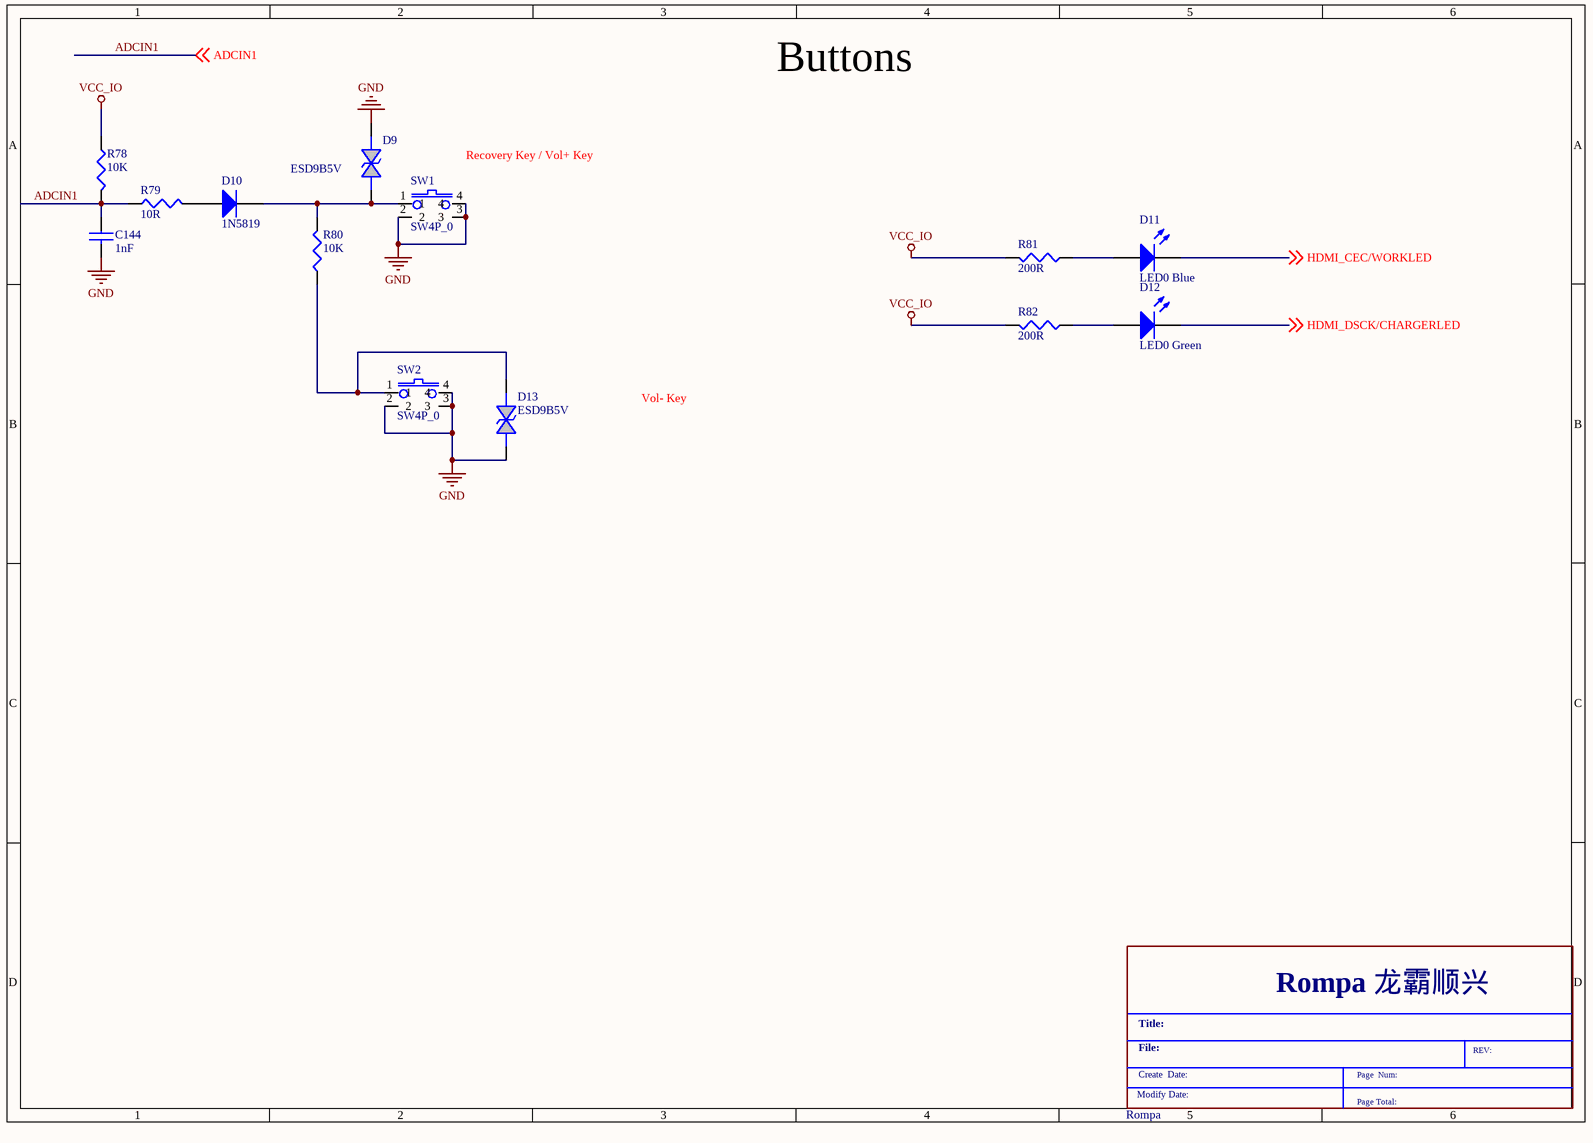
[diagram p8: Option_key.SchDoc]

### Parts
(Parts that share a designator on the sheet are numbered #1, #2 ... from top to bottom, then left to right.)
*#8  Rompa  (graphical)
C144  1nF  [C0402]
D9  ESD9B5V
D10  1N5819
D11  LED0 Blue  [1608[0603]]
D12  LED0 Green  [1608[0603]]
D13  ESD9B5V
R78  10K  [R0402]
R79  10R  [R0402]
R80  10K  [R0402]
R81  200R  [R0402]
R82  200R  [R0402]
SW1  SW4P_0
SW2  SW4P_0

### Nets
GND: C144.2 D9.2 D13.2 SW1.2 SW1.3 SW1.4 SW2.2 SW2.3 SW2.4
VCC_IO: R78.1 R81.2 R82.2
ADCIN1: C144.1 R78.2 R79.1 ; off-sheet ADCIN1
HDMI_CEC/WORKLED: D11.2(K) ; off-sheet HDMI_CEC/WORKLED
HDMI_DSCK/CHARGERLED: D12.2(K) ; off-sheet HDMI_DSCK/CHARGERLED
NetD9_1: D9.1 D10.2(K) R80.2 SW1.1
NetD10_1: D10.1(A) R79.2
NetD11_1: D11.1(A) R81.1
NetD12_1: D12.1(A) R82.1
NetD13_1: D13.1 R80.1 SW2.1

### Notes on the sheet
- Buttons
- (near SW1) Recovery Key / Vol+ Key
- Vol- Key
- (in symbol Rompa) Rompa 龙霸顺兴; Title:; File:; REV:; Create  Date:; Page  Num:; Modify Date:; Page Total:

### Library data of the parts
C144 = CAP NP: 16V
D9 D13 = DIODE BI-DIR TRIG: FP:E0402N
D10 = Diode: Published: 8-Jun-2000; LatestRevisionDate: 17-Jul-2002; LatestRevisionNote: Re-released for DXP Platform.; PackageDocument: Sep-1996; PackageReference: SMC; Publisher: Altium Limited; Code_JEDEC: DO-214-AB
D11 D12 = LED0: Typical INFRARED GaAs LED   Blue; Published: 8-Jun-2000; LatestRevisionDate: 08-Jul-2005; LatestRevisionNote: Mech Layer 1 removed.; PackageReference: LED-0; Publisher: Altium Limited
R78 = RESISTOR: %1
R79-R82 = RESISTOR

## Sheet Option_AP6xxx.SchDoc
size 297 x 209 mm
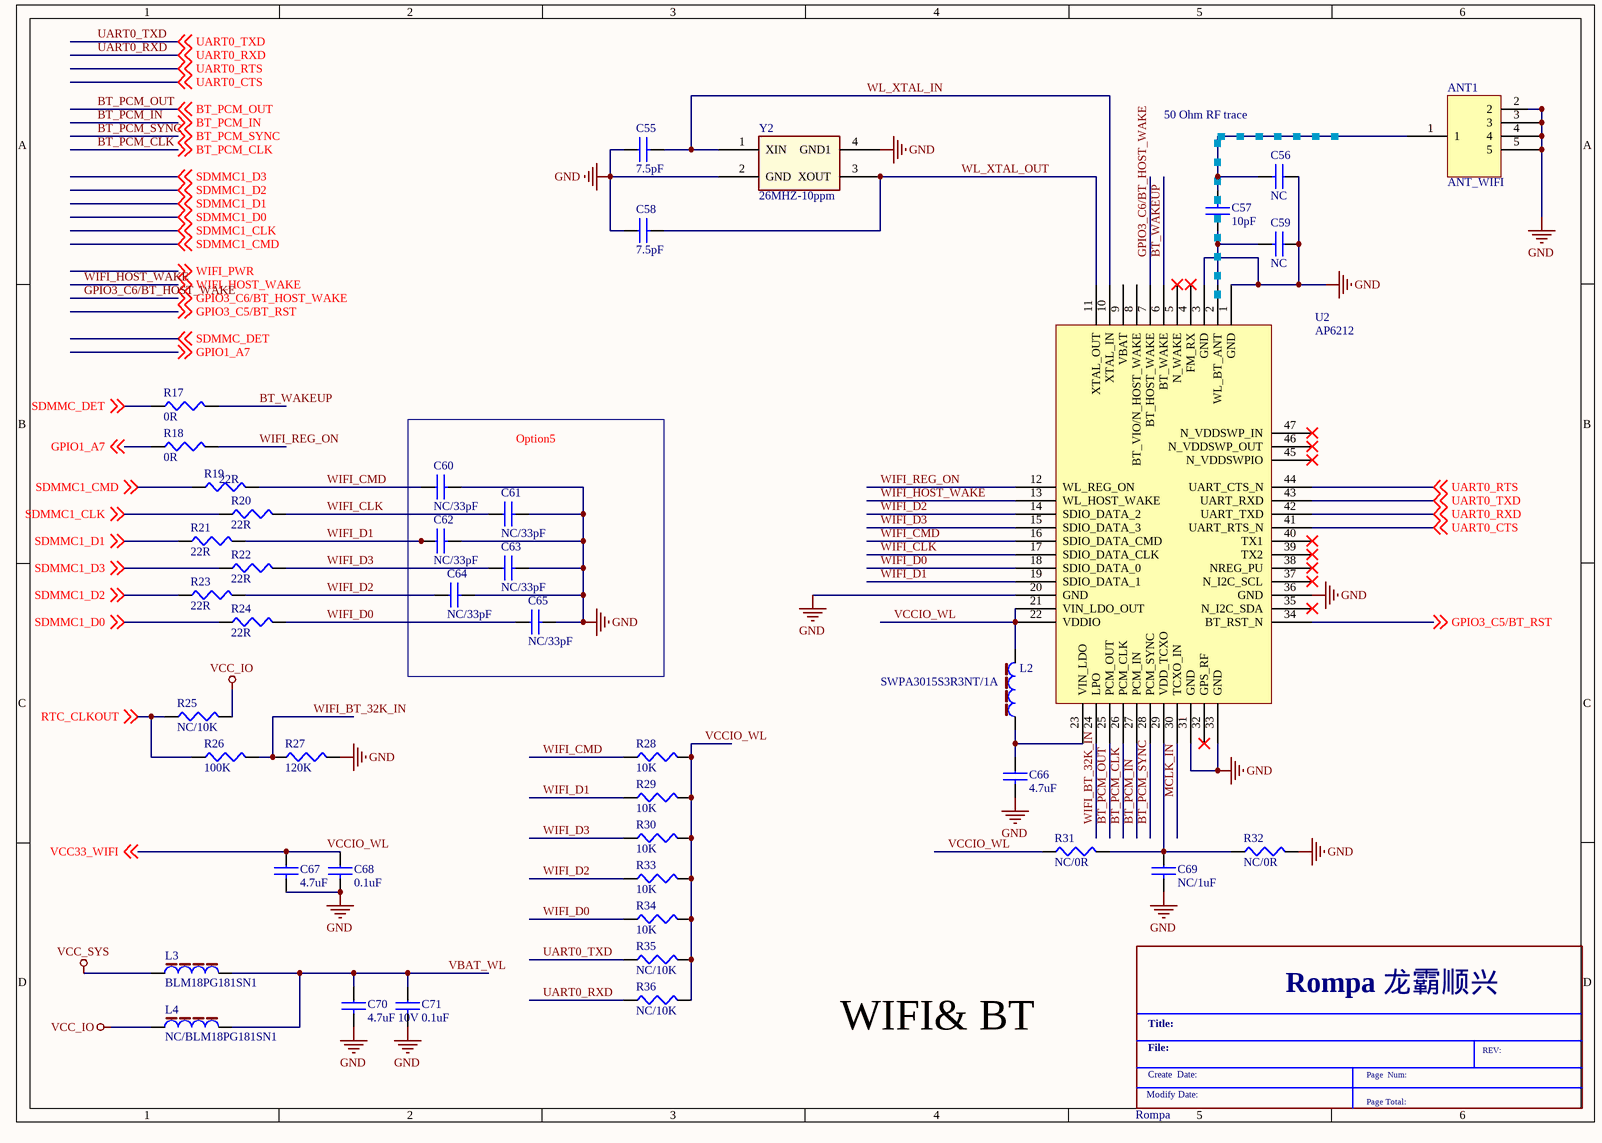
[diagram p9: Option_AP6xxx.SchDoc]

### Parts
(Parts that share a designator on the sheet are numbered #1, #2 ... from top to bottom, then left to right.)
*#9  Rompa  (graphical)
ANT1  ANT_WIFI
C55  7.5pF  [C0402]
C56  NC  [C0402]
C57  10pF  [C0402]
C58  7.5pF  [C0402]
C59  NC  [C0402]
C60  NC/33pF  [C0402]
C61  NC/33pF  [C0402]
C62  NC/33pF  [C0402]
C63  NC/33pF  [C0402]
C64  NC/33pF  [C0402]
C65  NC/33pF  [C0402]
C66  4.7uF  [C0603]
C67  4.7uF  [C0603]
C68  0.1uF  [C0402]
C69  NC/1uF  [C0402]
C70  4.7uF 10V  [C0603]
C71  0.1uF  [C0402]
L2  SWPA3015S3R3NT/1A
L3  BLM18PG181SN1  [L0603]
L4  NC/BLM18PG181SN1  [L0603]
R17  0R  [R0402]
R18  0R  [R0402]
R19  22R  [R0402]
R20  22R  [R0402]
R21  22R  [R0402]
R22  22R  [R0402]
R23  22R  [R0402]
R24  22R  [R0402]
R25  NC/10K  [R0402]
R26  100K  [R0402]
R27  120K  [R0402]
R28  10K  [R0402]
R29  10K  [R0402]
R30  10K  [R0402]
R31  NC/0R  [R0402]
R32  NC/0R  [R0402]
R33  10K  [R0402]
R34  10K  [R0402]
R35  NC/10K  [R0402]
R36  NC/10K  [R0402]
U2  AP6212
Y2  26MHZ-10ppm  [CRY-3225]

### Blocks framed on the sheet
Option5: C60-C65

### Nets
GND: ANT1.2 ANT1.3 ANT1.4 ANT1.5 C55.1 C56.1 C58.1 C59.1 C60.2 C61.2 C62.2 C63.2 C64.2 C65.2 C66.2 C67.2 C68.2 C69.2 C70.2 C71.2 R27.2 R32.2 U2.1(GND) U2.3(GND) U2.20(GND) U2.31(GND) U2.33(GND) U2.36(GND) Y2.2(GND) Y2.4(GND1)
VCC_IO: L4.1 R25.2
VCC_SYS: L3.1
BT_PCM_CLK: U2.26(PCM_CLK) ; off-sheet BT_PCM_CLK
BT_PCM_IN: U2.27(PCM_IN) ; off-sheet BT_PCM_IN
BT_PCM_OUT: U2.25(PCM_OUT) ; off-sheet BT_PCM_OUT
BT_PCM_SYNC: U2.28(PCM_SYNC) ; off-sheet BT_PCM_SYNC
BT_WAKEUP: R17.2 U2.6(BT_WAKE)
GPIO1_A7: R18.1 ; off-sheet GPIO1_A7
GPIO3_C5/BT_RST: U2.34(BT_RST_N) ; off-sheet GPIO3_C5/BT_RST
GPIO3_C6/BT_HOST_WAKE: U2.7(BT_HOST_WAKE) ; off-sheet GPIO3_C6/BT_HOST_WAKE
MCLK_IN: U2.30(TCXO_IN)
RTC_CLKOUT: R25.1 R26.1 ; off-sheet RTC_CLKOUT
SDMMC1_CLK: R20.1 ; off-sheet SDMMC1_CLK
SDMMC1_CMD: R19.1 ; off-sheet SDMMC1_CMD
SDMMC1_D0: R24.1 ; off-sheet SDMMC1_D0
SDMMC1_D1: R21.1 ; off-sheet SDMMC1_D1
SDMMC1_D2: R23.1 ; off-sheet SDMMC1_D2
SDMMC1_D3: R22.1 ; off-sheet SDMMC1_D3
SDMMC_DET: R17.1 ; off-sheet SDMMC_DET
UART0_CTS: U2.41(UART_RTS_N) ; off-sheet UART0_CTS
UART0_RTS: U2.44(UART_CTS_N) ; off-sheet UART0_RTS
UART0_RXD: R36.1 U2.42(UART_TXD) ; off-sheet UART0_RXD
UART0_TXD: R35.1 U2.43(UART_RXD) ; off-sheet UART0_TXD
VBAT_WL: C70.1 C71.1 L3.2 L4.2
VCCIO_WL: C67.1 C68.1 L2.2 R28.2 R29.2 R30.2 R31.1 R33.2 R34.2 R35.2 R36.2 U2.21(VIN_LDO_OUT) U2.22(VDDIO) ; off-sheet VCC33_WIFI  [also labelled VCC33_WIFI]
WIFI_BT_32K_IN: R26.2 R27.1 U2.24(LPO)
WIFI_CLK: C61.1 R20.2 U2.17(SDIO_DATA_CLK)
WIFI_CMD: C60.1 R19.2 R28.1 U2.16(SDIO_DATA_CMD)
WIFI_D0: C65.1 R24.2 R34.1 U2.18(SDIO_DATA_0)
WIFI_D1: C62.1 R21.2 R29.1 U2.19(SDIO_DATA_1)
WIFI_D2: C64.1 R23.2 R33.1 U2.14(SDIO_DATA_2)
WIFI_D3: C63.1 R22.2 R30.1 U2.15(SDIO_DATA_3)
WIFI_HOST_WAKE: U2.13(WL_HOST_WAKE) ; off-sheet WIFI_HOST_WAKE
WIFI_REG_ON: R18.2 U2.12(WL_REG_ON)
WL_XTAL_IN: C55.2 U2.10(XTAL_IN) Y2.1(XIN)
WL_XTAL_OUT: C58.2 U2.11(XTAL_OUT) Y2.3(XOUT)
NetANT1_1: ANT1.1 C56.2 C57.2
NetC57_1: C57.1 C59.2 U2.2(WL_BT_ANT)
NetC66_1: C66.1 L2.1 U2.23(VIN_LDO)
NetC69_1: C69.1 R31.2 R32.1 U2.29(VDD_TCXO)

Not connected (* = marked no-connect by the designer): U2 4(FM_RX)* 5(N_WAKE)* 8(BT_VIO/N_HOST_WAKE) 9(VBAT) 32(GPS_RF)* 35(N_I2C_SDA)* 37(N_I2C_SCL)* 38(NREG_PU)* 39(TX2)* 40(TX1)* 45(N_VDDSWPIO)* 46(N_VDDSWP_OUT)* 47(N_VDDSWP_IN)*

### Notes on the sheet
- 50 Ohm RF trace
- WIFI& BT
- (in symbol Rompa) Rompa 龙霸顺兴; Title:; File:; REV:; Create  Date:; Page  Num:; Modify Date:; Page Total:

### Library data of the parts
ANT1 = AP6xxx_ANT
C55-C65 C68 C69 C71 = CAP NP
C66 = CAP NP_Dup1: 10V
C67 = CAP NP_Dup1: 6.3V
C70 = CAP NP_Dup1
L2 = INDUCTOR_2: IND_3x3  3.3uH/1A
L3 L4 = INDUCTOR_2
R17-R36 = RESISTOR
U2 = AP6xxx
Y2 = CRYSTAL-4_0

## Sheet Option_PMIC_RK808.SchDoc
size 297 x 209 mm
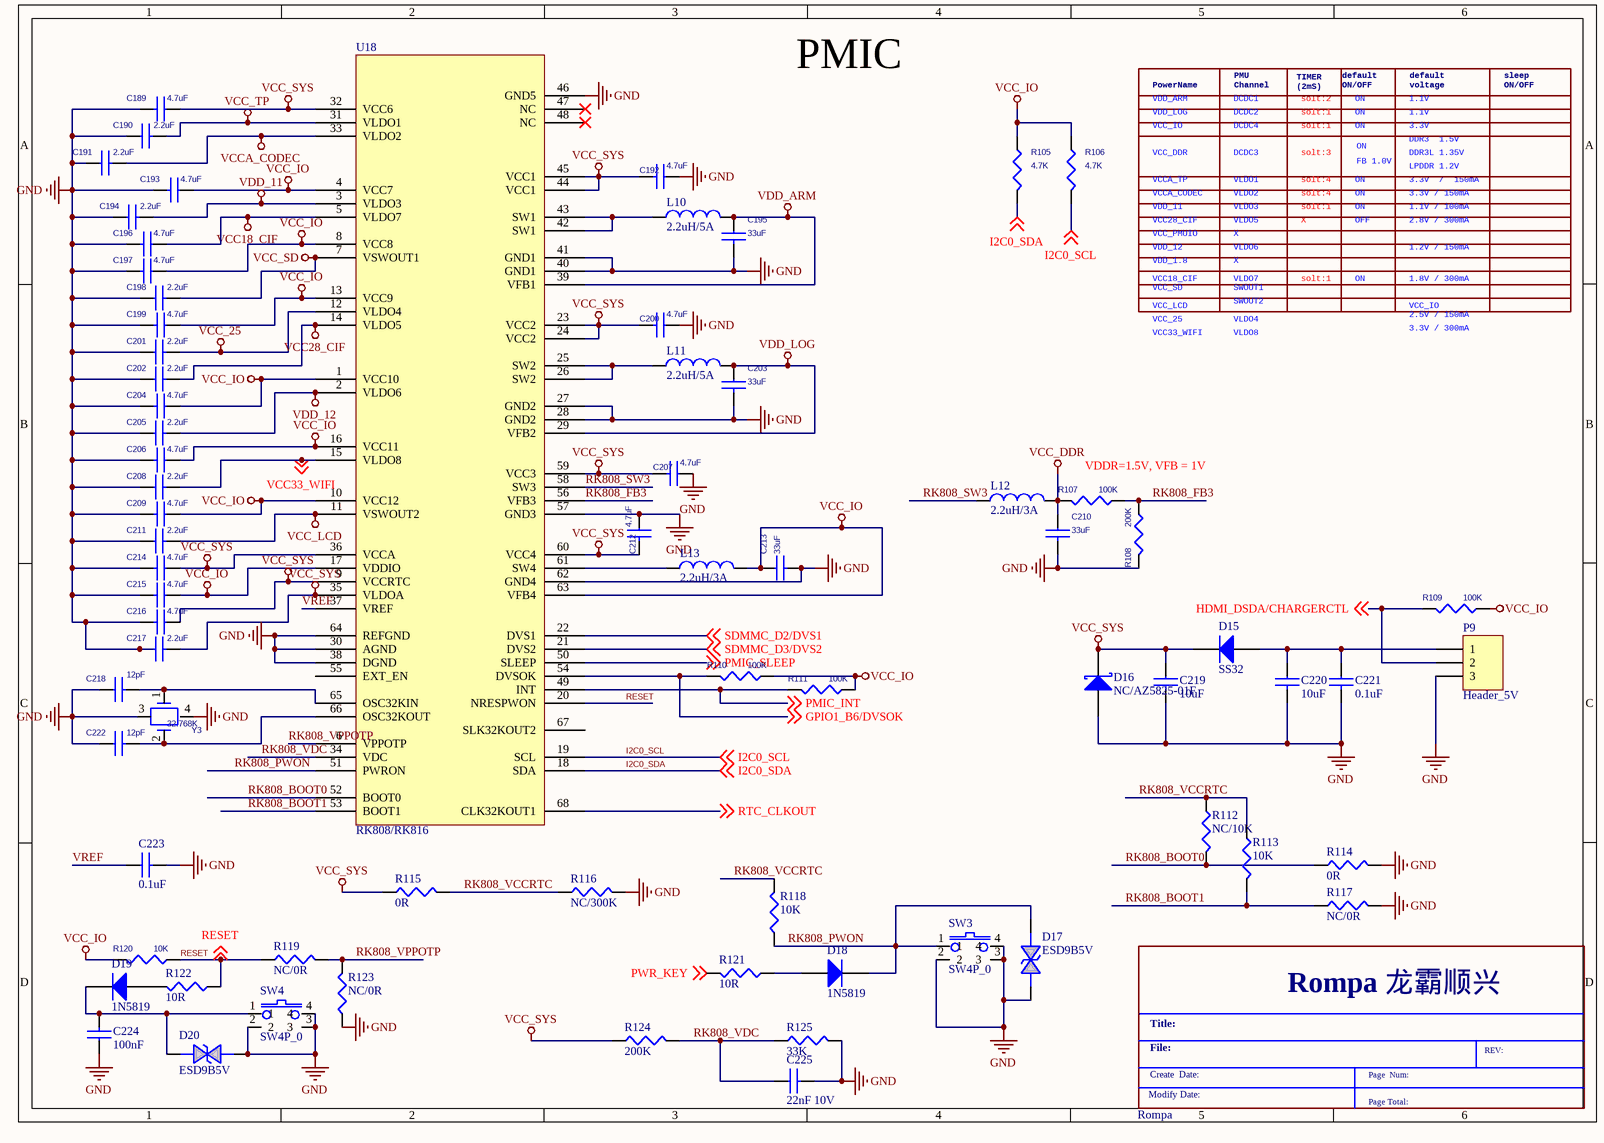
[diagram p10: Option_PMIC_RK808.SchDoc]

### Parts
(Parts that share a designator on the sheet are numbered #1, #2 ... from top to bottom, then left to right.)
*#10  Rompa  (graphical)
C189  4.7uF  [C0603]
C190  2.2uF  [C0402]
C191  2.2uF  [C0402]
C192  4.7uF  [C0603]
C193  4.7uF  [C0603]
C194  2.2uF  [C0402]
C195  33uF  [C0805]
C196  4.7uF  [C0603]
C197  4.7uF  [C0603]
C198  2.2uF  [C0402]
C199  4.7uF  [C0603]
C200  4.7uF  [C0603]
C201  2.2uF  [C0402]
C202  2.2uF  [C0402]
C203  33uF  [C0805]
C204  4.7uF  [C0603]
C205  2.2uF  [C0402]
C206  4.7uF  [C0603]
C207  4.7uF  [C0603]
C208  2.2uF  [C0402]
C209  4.7uF  [C0603]
C210  33uF  [C0805]
C211  2.2uF  [C0402]
C212  4.7uF  [C0603]
C213  33uF  [C0805]
C214  4.7uF  [C0603]
C215  4.7uF  [C0603]
C216  4.7uF  [C0603]
C217  2.2uF  [C0402]
C218  12pF  [C0402]
C219  10uF  [C0805]
C220  10uF  [C0805]
C221  0.1uF  [C0402]
C222  12pF  [C0402]
C223  0.1uF  [C0402]
C224  100nF  [C0402]
C225  22nF 10V  [C0402]
D15  SS32
D16  NC/AZ5825-01F
D17  ESD9B5V
D18  1N5819
D19  1N5819
D20  ESD9B5V
L10  2.2uH/5A
L11  2.2uH/5A
L12  2.2uH/3A
L13  2.2uH/3A
P9  Header_5V  [HDR1X3]
R105  4.7K  [R0402]
R106  4.7K  [R0402]
R107  100K  [R0402]
R108  200K  [R0402]
R109  100K  [R0402]
R110  100K  [R0402]
R111  100K  [R0402]
R112  NC/10K  [R0402]
R113  10K  [R0402]
R114  0R  [R0402]
R115  0R  [R0402]
R116  NC/300K  [R0402]
R117  NC/0R  [R0402]
R118  10K  [R0402]
R119  NC/0R  [R0402]
R120  10K  [R0402]
R121  10R  [R0402]
R122  10R  [R0402]
R123  NC/0R  [R0402]
R124  200K  [R0402]
R125  33K  [R0402]
SW3  SW4P_0
SW4  SW4P_0
U18  RK808/RK816
Y3  32.768K  [CRY_MC146]

### Nets
GND: C189.2 C190.1 C191.1 C192.1 C193.2 C194.1 C195.2 C196.2 C197.2 C198.1 C199.2 C200.1 C201.1 C202.1 C203.2 C204.2 C205.1 C206.2 C207.1 C208.1 C209.2 C210.2 C211.1 C212.1 C213.2 C214.2 C215.2 C216.2 C217.1 C218.1 C219.2 C220.2 C221.2 C222.1 C223.2 C224.1 C225.2 D16.1(A) D17.2 D20.2 P9.3 R108.1 R114.2 R116.2 R117.2 R123.1 R125.2 SW3.2 SW3.3 SW3.4 SW4.2 SW4.3 SW4.4 U18.27(GND2) U18.28(GND2) U18.30(AGND) U18.38(DGND) U18.40(GND1) U18.41(GND1) U18.46(GND5) U18.57(GND3) U18.62(GND4) U18.64(REFGND) Y3.3 Y3.4
VCC18_CIF: C196.1 U18.5(VLDO7)
VCC28_CIF: C202.2 U18.14(VLDO5)
VCC_25: C201.2 U18.12(VLDO4)
VCC_DDR: C210.1 L12.2 R107.1
VCC_IO: C193.1 C197.1 C199.1 C204.1 C206.1 C209.1 C213.1 C215.1 L13.2 R105.1 R106.1 R109.2 R110.2 R111.2 R120.1 U18.1(VCC10) U18.4(VCC7) U18.8(VCC8) U18.10(VCC12) U18.13(VCC9) U18.16(VCC11) U18.17(VDDIO) U18.63(VFB4)
VCC_LCD: C211.2 U18.11(VSWOUT2)
VCC_SD: C198.2 U18.7(VSWOUT1)
VCC_SYS: C189.1 C192.2 C200.2 C207.2 C212.2 C214.1 C216.1 C217.2 C219.1 D15.2(K) D16.3(K) R115.1 R124.1 U18.9(VCCRTC) U18.23(VCC2) U18.24(VCC2) U18.32(VCC6) U18.35(VLDOA) U18.36(VCCA) U18.44(VCC1) U18.45(VCC1) U18.59(VCC3) U18.60(VCC4)
VCC_TP: C190.2 U18.31(VLDO1)
VCCA_CODEC: C191.2 U18.33(VLDO2)
VDD_11: C194.2 U18.3(VLDO3)
VDD_12: C205.2 U18.2(VLDO6)
VDD_ARM: C195.1 L10.2 U18.39(VFB1)
VDD_LOG: C203.1 L11.2 U18.29(VFB2)
GPIO1_B6/DVSOK: R110.1 U18.54(DVSOK) ; off-sheet GPIO1_B6/DVSOK
HDMI_DSDA/CHARGERCTL: P9.2 R109.1 ; off-sheet HDMI_DSDA/CHARGERCTL
I2C0_SCL: R106.2 U18.19(SCL) ; off-sheet I2C0_SCL
I2C0_SDA: R105.2 U18.18(SDA) ; off-sheet I2C0_SDA
PMIC_INT: R111.1 U18.49(INT) ; off-sheet PMIC_INT
PMIC_SLEEP: U18.50(SLEEP) ; off-sheet PMIC_SLEEP
PWR_KEY: R121.2 ; off-sheet PWR_KEY
RESET: R119.1 R120.2 R122.1 U18.20(NRESPWON) ; off-sheet RESET
RK808_BOOT0: R112.2 R114.1 U18.52(BOOT0)
RK808_BOOT1: R113.2 R117.1 U18.53(BOOT1)
RK808_FB3: R107.2 R108.2 U18.56(VFB3)
RK808_PWON: D17.1 D18.2(K) R118.1 SW3.1 U18.51(PWRON)
RK808_SW3: L12.1 U18.58(SW3)
RK808_VCCRTC: R112.1 R113.1 R115.2 R116.1 R118.2
RK808_VDC: C225.1 R124.2 R125.1 U18.34(VDC)
RK808_VPPOTP: R119.2 R123.2 U18.6(VPPOTP)
RTC_CLKOUT: U18.68(CLK32KOUT1) ; off-sheet RTC_CLKOUT
SDMMC_D2/DVS1: U18.22(DVS1) ; off-sheet SDMMC_D2/DVS1
SDMMC_D3/DVS2: U18.21(DVS2) ; off-sheet SDMMC_D3/DVS2
VCC33_WIFI: C208.2 U18.15(VLDO8) ; off-sheet VCC33_WIFI  [project net VCCIO_WL]
VREF: C223.1 U18.37(VREF)
NetC218_2: C218.2 U18.65(OSC32KIN) Y3.1
NetC220_1: C220.1 C221.1 D15.1(A) P9.1
NetC222_2: C222.2 U18.66(OSC32KOUT) Y3.2
NetC224_2: C224.2 D19.2(K) D20.1 SW4.1
NetD18_1: D18.1(A) R121.1
NetD19_1: D19.1(A) R122.2
NetL10_1: L10.1 U18.42(SW1) U18.43(SW1)
NetL11_1: L11.1 U18.25(SW2) U18.26(SW2)
NetL13_1: L13.1 U18.61(SW4)

Not connected (* = marked no-connect by the designer): U18 47(NC)* 48(NC)* 55(EXT_EN) 67(SLK32KOUT2)

### Notes on the sheet
- PMIC
- VDD_ARM
- VCC_IO
- PowerName
- VDD_LOG
- DCDC4
- PMU
  Channel
- DCDC2
- DCDC1
- TIMER
  (2mS)
- solt:1
- solt:2
- default
  ON/OFF
- ON
- default
  voltage
- 1.1V
- 3.3V
- sleep
  ON/OFF
- VCC_DDR
- VCCA_TP
- VCCA_CODEC
- DCDC3
- VLDO2
- VLDO1
- solt:3
- solt:4
- FB 1.0V
- DDR3  1.5V
- 3.3V  /  150mA
- LPDDR 1.2V
- DDR3L 1.35V
- 3.3V / 150mA
- VDD_11
- VCC28_CIF
- VCC_PMUIO
- VDD_12
- VDD_1.8
- VLDO5
- VLDO3
- X
- VLDO6
- OFF
- 1.1V / 100mA
- 2.8V / 300mA
- 1.2V / 150mA
- VCC_LCD
- VCC18_CIF
- VCC_SD
- VCC_25
- VCC33_WIFI
- VLDO7
- SWOUT1
- SWOUT2
- VLDO4
- VLDO8
- 1.8V / 300mA
- 2.5V / 150mA
- 3.3V / 300mA
- VDDR=1.5V, VFB = 1V
- (in symbol Rompa) Rompa 龙霸顺兴; Title:; File:; REV:; Create  Date:; Page  Num:; Modify Date:; Page Total:

### Library data of the parts
C189-C218 C222 = CAP NP_4
C219 C220 = CAP NP_Dup1: 10V X5R
C221 C223 C225 = CAP NP
C224 = CAP NP: 16V X7R
D15 = Diode: SOD123; Published: 8-Jun-2000; LatestRevisionDate: 17-Jul-2002; LatestRevisionNote: Re-released for DXP Platform.; PackageDocument: Sep-1996; PackageReference: SMC; Publisher: Altium Limited; Code_JEDEC: DO-214-AB
D16 = Diode BAS70: AMAZING, FP:DFN1006P2E; Note: Pin 2 is not connected and not drawn.; Published: 21-Mar-2003; DatasheetDocument: Oct-1999; PackageDocument: Sep-2001; PackageReference: SOT-23; Publisher: Altium Limited; ComponentLink1Description: Manufacturer Link; ComponentLink1URL: http://www.infineon.com/; ComponentLink2Description: Datasheet; ComponentLink2URL: http://www.infineon.com/upload/Document/cmc_upload/documents/009/382/bas40_bas140series_1.pdf
D17 D20 = DIODE BI-DIR TRIG: FP:E0402N
D18 D19 = Diode: Published: 8-Jun-2000; LatestRevisionDate: 17-Jul-2002; LatestRevisionNote: Re-released for DXP Platform.; PackageDocument: Sep-1996; PackageReference: SMC; Publisher: Altium Limited; Code_JEDEC: DO-214-AB
L10-L13 = Inductor
P9 = Header 3: Header, 3-Pin; LatestRevisionDate: 17-Jul-2002; LatestRevisionNote: Re-released for DXP Platform.; Publisher: Altium Limited
R105 R106 = RES 1B: ROHS CHIP RES 4.7K 1/16W 5%
R107 R108 = RESISTOR_1: %1
R109-R111 R120 = RESISTOR_1: RES,thick film,47KOhm,+/-5%,1/16W,SMD0402
R112-R119 R121-R125 = RESISTOR
U18 = RK808
Y3 = CRYSTAL_0: Crystal,32.768KHz,+/-30ppm,12pF,MC146,-10°C ~ +60   °C; Part Type: 晶体类\无源晶体

## Sheet Option_Charger.SchDoc
size 297 x 209 mm
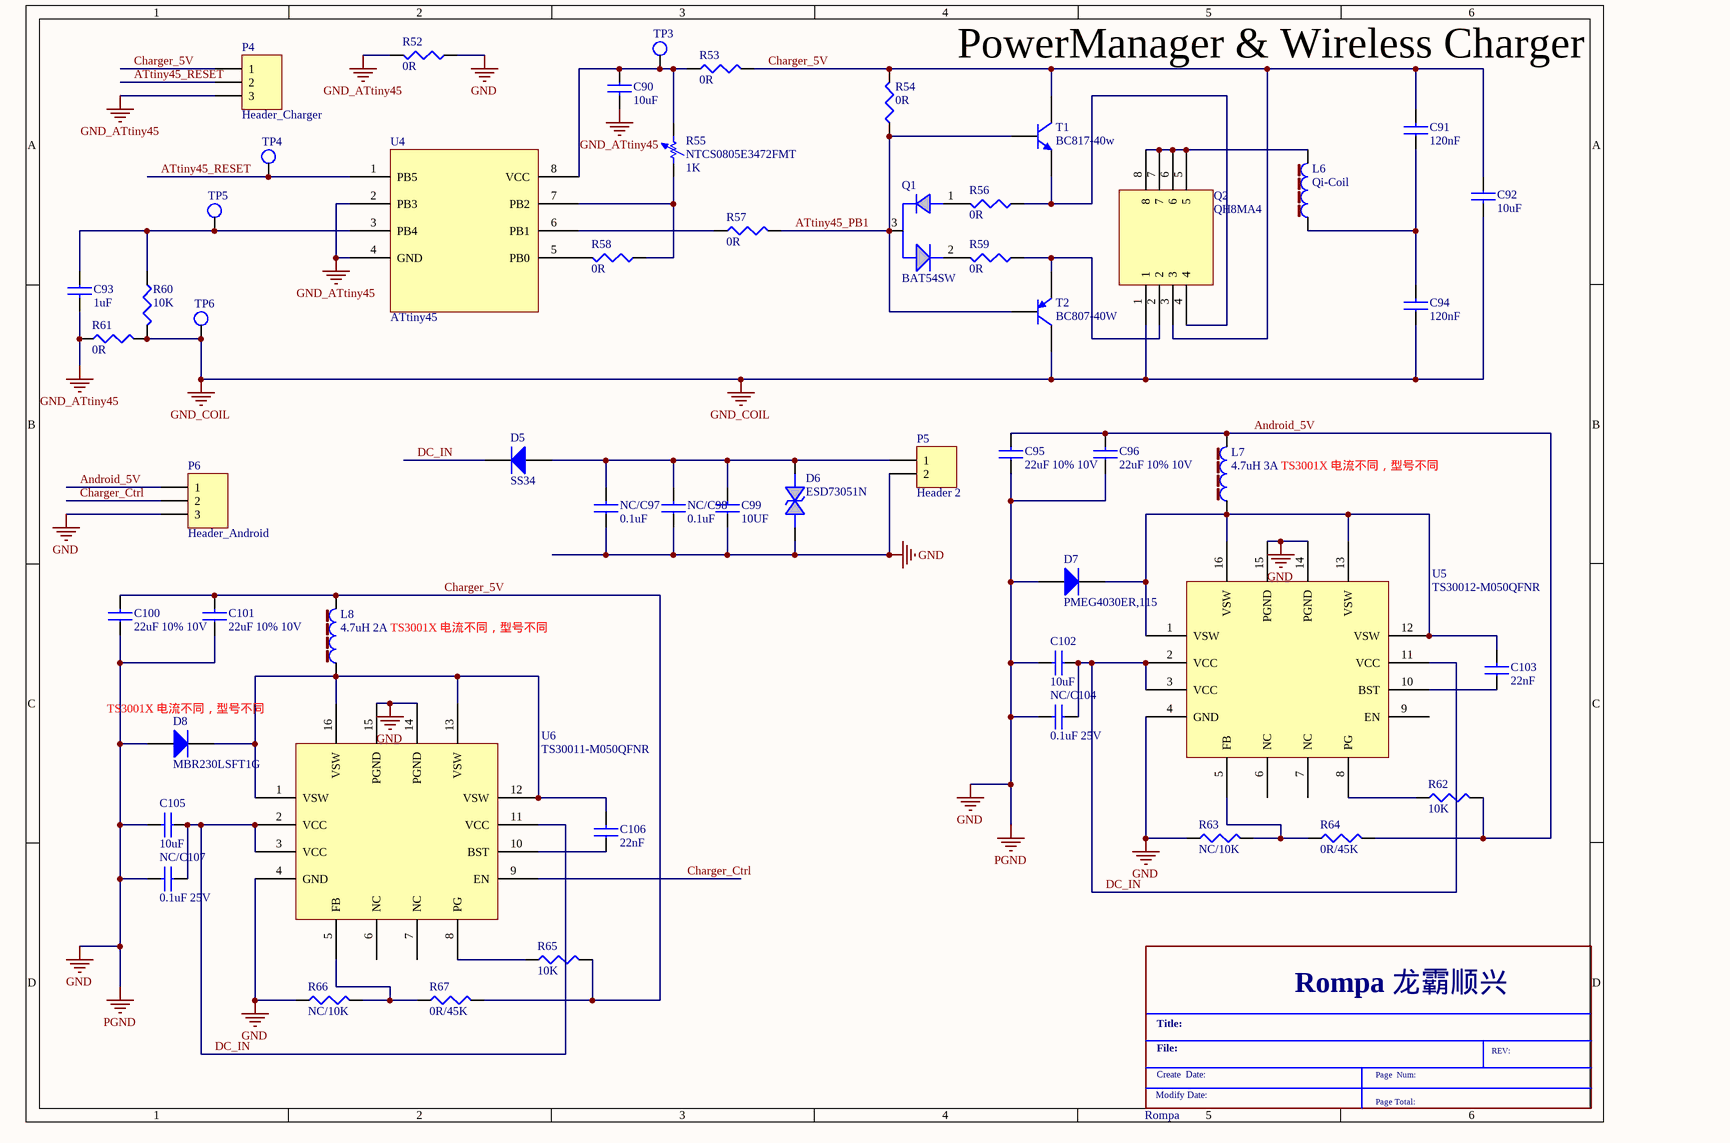
[diagram p11: Option_Charger.SchDoc]

### Parts
(Parts that share a designator on the sheet are numbered #1, #2 ... from top to bottom, then left to right.)
*#11  Rompa  (graphical)
C90  10uF  [2012[0805]]
C91  120nF  [C1206]
C92  10uF  [C0805]
C93  1uF  [C0805]
C94  120nF  [C1206]
C95  22uF 10% 10V  [C0805]
C96  22uF 10% 10V  [C0805]
C99  10UF  [C1210]
C100  22uF 10% 10V  [C0805]
C101  22uF 10% 10V  [C0805]
C102  10uF  [C1206]
C103  22nF  [C0402]
C105  10uF  [C1206]
C106  22nF  [C0402]
D5  SS34
D6  ESD73051N
D7  PMEG4030ER,115
D8  MBR230LSFT1G
L6  Qi-Coil
L7  4.7uH 3A
L8  4.7uH 2A
NC/C97  0.1uF  [C0805]
NC/C98  0.1uF  [C0805]
NC/C104  0.1uF 25V  [C0402]
NC/C107  0.1uF 25V  [C0402]
P4  Header_Charger  [HDR1X3]
P5  Header 2  [HDR1X2]
P6  Header_Android  [HDR1X3]
Q1  BAT54SW
Q2  QH8MA4  [TSMT8]
R52  0R  [R0402]
R53  0R  [R0402]
R54  0R  [R0402]
R55  NTCS0805E3472FMT  value 1K  [2012[0805]]
R56  0R  [R0402]
R57  0R  [R0402]
R58  0R  [R0402]
R59  0R  [R0402]
R60  10K  [1608[0603]]
R61  0R  [R0402]
R62  10K  [R0402]
R63  NC/10K  [R0402]
R64  0R/45K  [R0402]
R65  10K  [R0402]
R66  NC/10K  [R0402]
R67  0R/45K  [R0402]
T1  BC817-40w
T2  BC807-40W
TP3  (no value)  [TEST]
TP4  (no value)  [TEST]
TP5  (no value)  [TEST]
TP6  (no value)  [TEST]
U4  ATtiny45  [8 pin SOIC_M]
U5  TS30012-M050QFNR  [16-QFN]
U6  TS30011-M050QFNR  [16-QFN]

### Nets
GND: C95.1 C96.1 C99.1 C100.1 C101.1 C102.2 C105.2 D6.1 D7.1(A) D8.1(A) NC/C97.1 NC/C98.1 NC/C104.2 NC/C107.2 P5.2 P6.3 R52.1 R63.1 R66.1 U5.4(GND) U5.14(PGND) U5.15(PGND) U6.4(GND) U6.14(PGND) U6.15(PGND)  [also labelled PGND]
GND_ATtiny45: C90.2 C93.2 P4.3 R52.2 R61.1 U4.2(PB3) U4.4(GND)
GND_COIL: C92.2 C94.1 Q2.1 R60.2 R61.2 T2.3(C) TP6.1
Android_5V: C95.2 C96.2 L7.2 P6.1 R62.2 R64.2
ATtiny45_PB1: Q1.3(K) R54.1 R57.2 T1.2(B) T2.2(B)
ATtiny45_RESET: P4.2 TP4.1 U4.1(PB5)
Charger_5V: C91.2 C92.1 C100.2 C101.2 L8.2 P4.1 Q2.3 R53.2 R54.2 R65.2 R67.2 T1.3(C)
Charger_Ctrl: P6.2 U6.9(EN)
DC_IN: C102.1 C105.1 D5.2(K) NC/C104.1 NC/C107.1 U5.2(VCC) U5.3(VCC) U5.11(VCC) U6.2(VCC) U6.3(VCC) U6.11(VCC)
NetC90_1: C90.1 R53.1 R55.2 TP3.1 U4.8(VCC)
NetC91_1: C91.1 C94.2 L6.1
NetC93_1: C93.1 R60.1 TP5.1 U4.3(PB4)
NetC99_2: C99.2 D5.1(A) D6.2 NC/C97.2 NC/C98.2 P5.1
NetC103_1: C103.1 U5.10(BST)
NetC103_2: C103.2 D7.2(K) L7.1 U5.1(VSW) U5.12(VSW) U5.13(VSW) U5.16(VSW)
NetC106_1: C106.1 U6.10(BST)
NetC106_2: C106.2 D8.2(K) L8.1 U6.1(VSW) U6.12(VSW) U6.13(VSW) U6.16(VSW)
NetL6_2: L6.2 Q2.5 Q2.6 Q2.7 Q2.8
NetQ1_1: Q1.1(A1) R56.2
NetQ1_2: Q1.2(A2) R59.2
NetQ2_2: Q2.2 R59.1 T2.1(E)
NetQ2_4: Q2.4 R56.1 T1.1(E)
NetR55_1: R55.1 R58.1 U4.7(PB2)
NetR57_1: R57.1 U4.6(PB1)
NetR58_2: R58.2 U4.5(PB0)
NetR62_1: R62.1 U5.8(PG)
NetR63_2: R63.2 R64.1 U5.5(FB)
NetR65_1: R65.1 U6.8(PG)
NetR66_2: R66.2 R67.1 U6.5(FB)

Not connected (* = marked no-connect by the designer): U5 6(NC) 7(NC) 9(EN); U6 6(NC) 7(NC)

### Notes on the sheet
- PowerManager & Wireless Charger
- TS3001X 电流不同，型号不同
- (near D8) TS3001X 电流不同，型号不同
- (in symbol Rompa) Rompa 龙霸顺兴; Title:; File:; REV:; Create  Date:; Page  Num:; Modify Date:; Page Total:

### Library data of the parts
C90 = CAP NP: C0805C106J8RACAUTO KEMET
C91 C94 = CAP NP: C1206C124J5RACTU KEMET  120nF, 50V, 5%, COG  CoiX7R (or better), 5%
C92 = CAP NP_Dup1: C0805C106J8RACAUTO KEMET 10U  CoiX7R (or better), 5%
C93 = CAP NP: C0805C105J3RACTU  KEMET
C95 C96 C100 C101 = CAP NP: C2012X5R1A226K125AB TDK
C99 = CAP NP: CAP CER 10UF 50V X7S 1210  C3225X7S1H106M250AB  TDK Corporation
C102 C105 = CAP NP: Capacitor  10uF 10% 35V TDK CGA5L3X5R1V106K160AB
C103 C106 = CAP NP: 15nF-200nF 10V TDK C1005X7R1C223K
D5 = Diode: Fairchild/ON Semiconductor     DO-214AB, SMC; Published: 8-Jun-2000; LatestRevisionDate: 17-Jul-2002; LatestRevisionNote: Re-released for DXP Platform.; PackageDocument: Sep-1996; PackageReference: SMC; Publisher: Altium Limited; Code_JEDEC: DO-214-AB
D6 = DIODE BI-DIR TRIG: FP=DFN1006-2L
D7 = Diode: 40V 3A  SOD-123 NXP Semiconductors; Published: 8-Jun-2000; LatestRevisionDate: 17-Jul-2002; LatestRevisionNote: Re-released for DXP Platform.; PackageDocument: Sep-1996; PackageReference: SMC; Publisher: Altium Limited; Code_JEDEC: DO-214-AB
D8 = Diode: 30V 2A  SOD-123FL On Semiconductor MBR230LSFT1G; Published: 8-Jun-2000; LatestRevisionDate: 17-Jul-2002; LatestRevisionNote: Re-released for DXP Platform.; PackageDocument: Sep-1996; PackageReference: SMC; Publisher: Altium Limited; Code_JEDEC: DO-214-AB
L6 = INDUCTOR_2
L7 = INDUCTOR_2: 4.7uH 3A TDK-----VLC5045T-4R7M   /  Wurth-----744774047
L8 = INDUCTOR_2: 4.7uH 2A     TDK---SLF7045T-4R7M2R0-PF  Wurth-----7447745047
NC/C97 NC/C98 = CAP NP: CGA3E2X7R1H104K080AA  TDK Corporation    0.1μF  ±10%  50V  X7R
NC/C104 NC/C107 = CAP NP
P4 P6 = Header 3: Header, 3-Pin; LatestRevisionDate: 17-Jul-2002; LatestRevisionNote: Re-released for DXP Platform.; Publisher: Altium Limited
P5 = Header 2: Header, 2-Pin; LatestRevisionDate: 17-Jul-2002; LatestRevisionNote: Re-released for DXP Platform.; Publisher: Altium Limited
Q1 = BAT54SW: SOT323
Q2 = QH8MA4: TSMT8
R52-R54 R56-R59 R61-R67 = RESISTOR
R55 = Res Adj1: 4K7 NTC 1%; Set Position: 0.5; Published: 8-Jun-2000; LatestRevisionDate: 17-Jul-2002; LatestRevisionNote: Re-released for DXP Platform.; PackageReference: AXIAL-0.7; Publisher: Altium Limited
R60 = RESISTOR: RC0603FR-0710KL Yageo
T1 = 2N3904: SOT323; Published: 8-Jun-2000; LatestRevisionDate: 15-Jan-2003; LatestRevisionNote: PCB Footprint 'BCY-W3/D4.7' replaced; DatasheetDocument: 1997; PackageDocument: Sep-1998; PackageReference: TO-92A; Publisher: Altium Limited; Code_JEDEC: TO-92A; ComponentLink1Description: Manufacturer Link; ComponentLink1URL: http://www.fairchildsemi.com/; ComponentLink2Description: Datasheet; ComponentLink2URL: http://www.fairchildsemi.com/ds/2N%2F2N3904.pdf
T2 = 2N3906: SOT323; Published: 8-Jun-2000; LatestRevisionDate: 15-Jan-2003; LatestRevisionNote: PCB Footprint 'BCY-W3/D4.7' replaced; DatasheetDocument: 1997; PackageDocument: Sep-1998; PackageReference: TO-92A; Publisher: Altium Limited; Code_JEDEC: TO-92A; ComponentLink1Description: Manufacturer Link; ComponentLink1URL: http://www.fairchildsemi.com/; ComponentLink2Description: Datasheet; ComponentLink2URL: http://www.fairchildsemi.com/ds/2N%2F2N3906.pdf
TP3-TP6 = TESTPOINT1_0
U6 = TS30012-M050QFNR

## Sheet Option_LighterSensor.SchDoc
size 297 x 209 mm
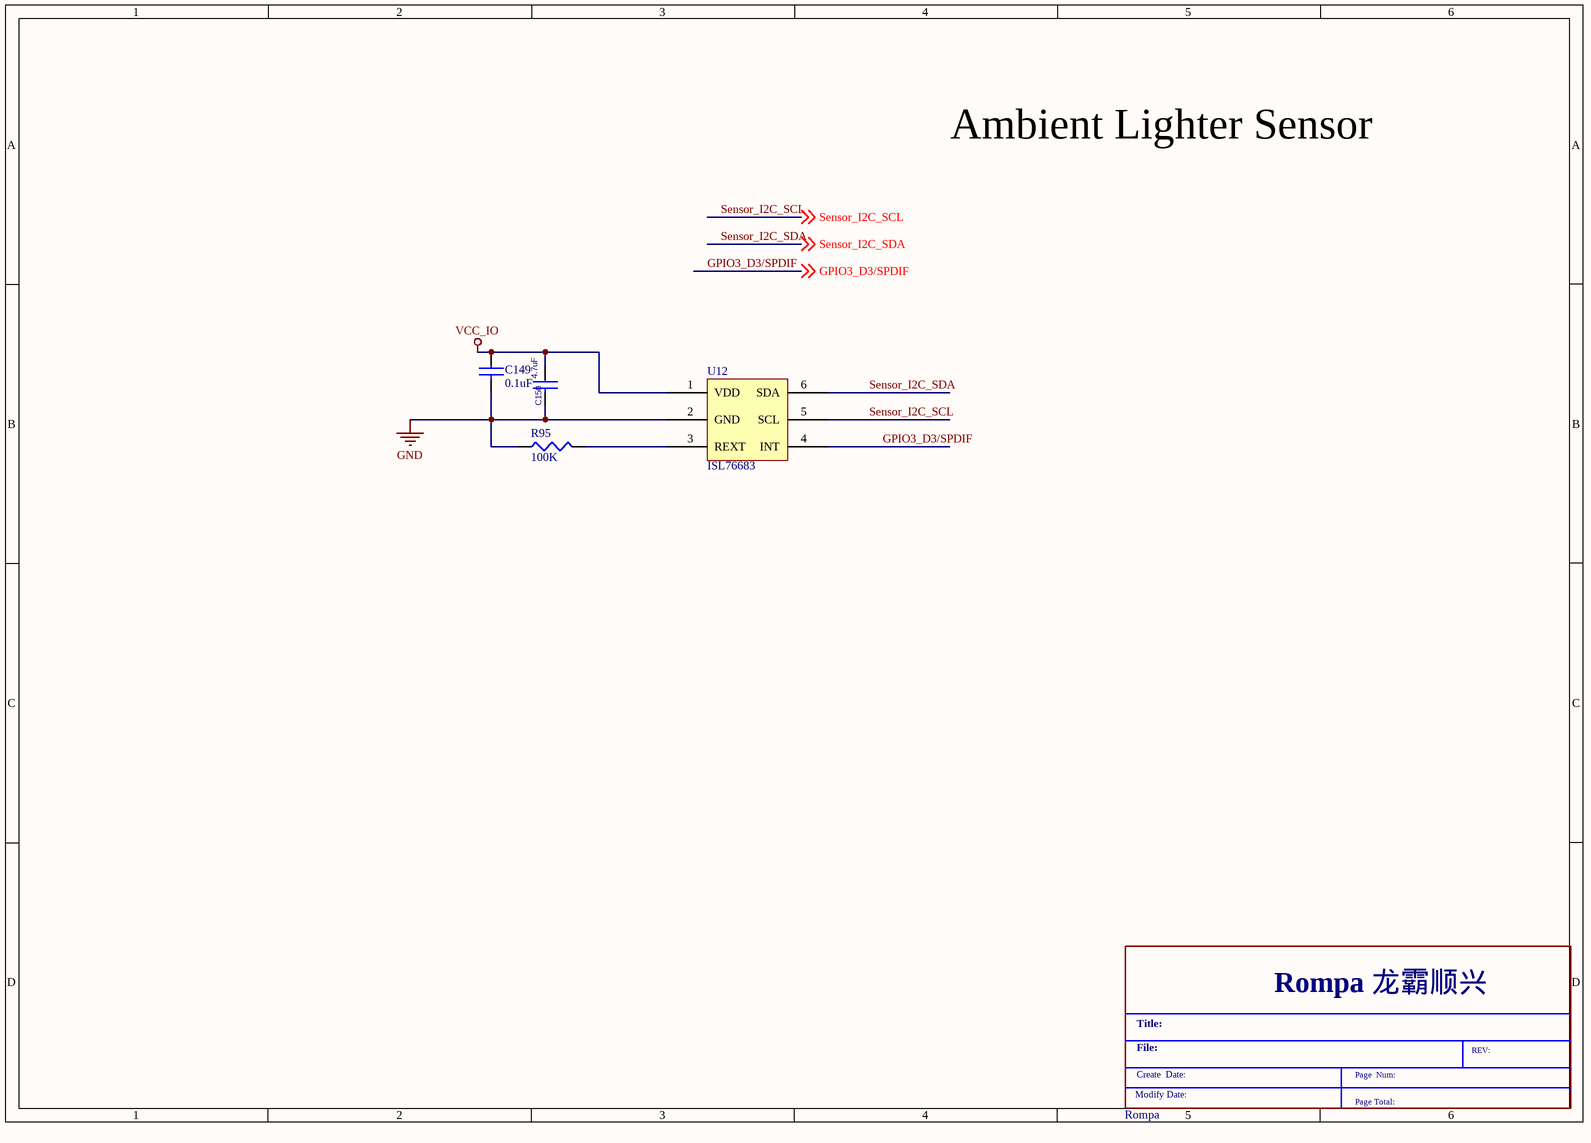
[diagram p12: Option_LighterSensor.SchDoc]

### Parts
(Parts that share a designator on the sheet are numbered #1, #2 ... from top to bottom, then left to right.)
*#12  Rompa  (graphical)
C149  0.1uF  [C0402]
C150  4.7uF  [C0603]
R95  100K  [R0402]
U12  ISL76683

### Nets
GND: C149.2 C150.2 R95.1 U12.2(GND)
VCC_IO: C149.1 C150.1 U12.1(VDD)
GPIO3_D3/SPDIF: U12.4(INT) ; off-sheet GPIO3_D3/SPDIF
Sensor_I2C_SCL: U12.5(SCL) U12.6(SDA) ; off-sheet Sensor_I2C_SDA, off-sheet Sensor_I2C_SCL  [also labelled Sensor_I2C_SDA]  [project net Camera_I2C_SCL]
NetR95_2: R95.2 U12.3(REXT)

### Notes on the sheet
- Ambient Lighter Sensor
- (in symbol Rompa) Rompa 龙霸顺兴; Title:; File:; REV:; Create  Date:; Page  Num:; Modify Date:; Page Total:

### Library data of the parts
C149 = CAP NP
C150 = CAP NP_4
R95 = RESISTOR

## Sheet Option_Humidity_Tempture_Sensor.SchDoc
size 297 x 209 mm
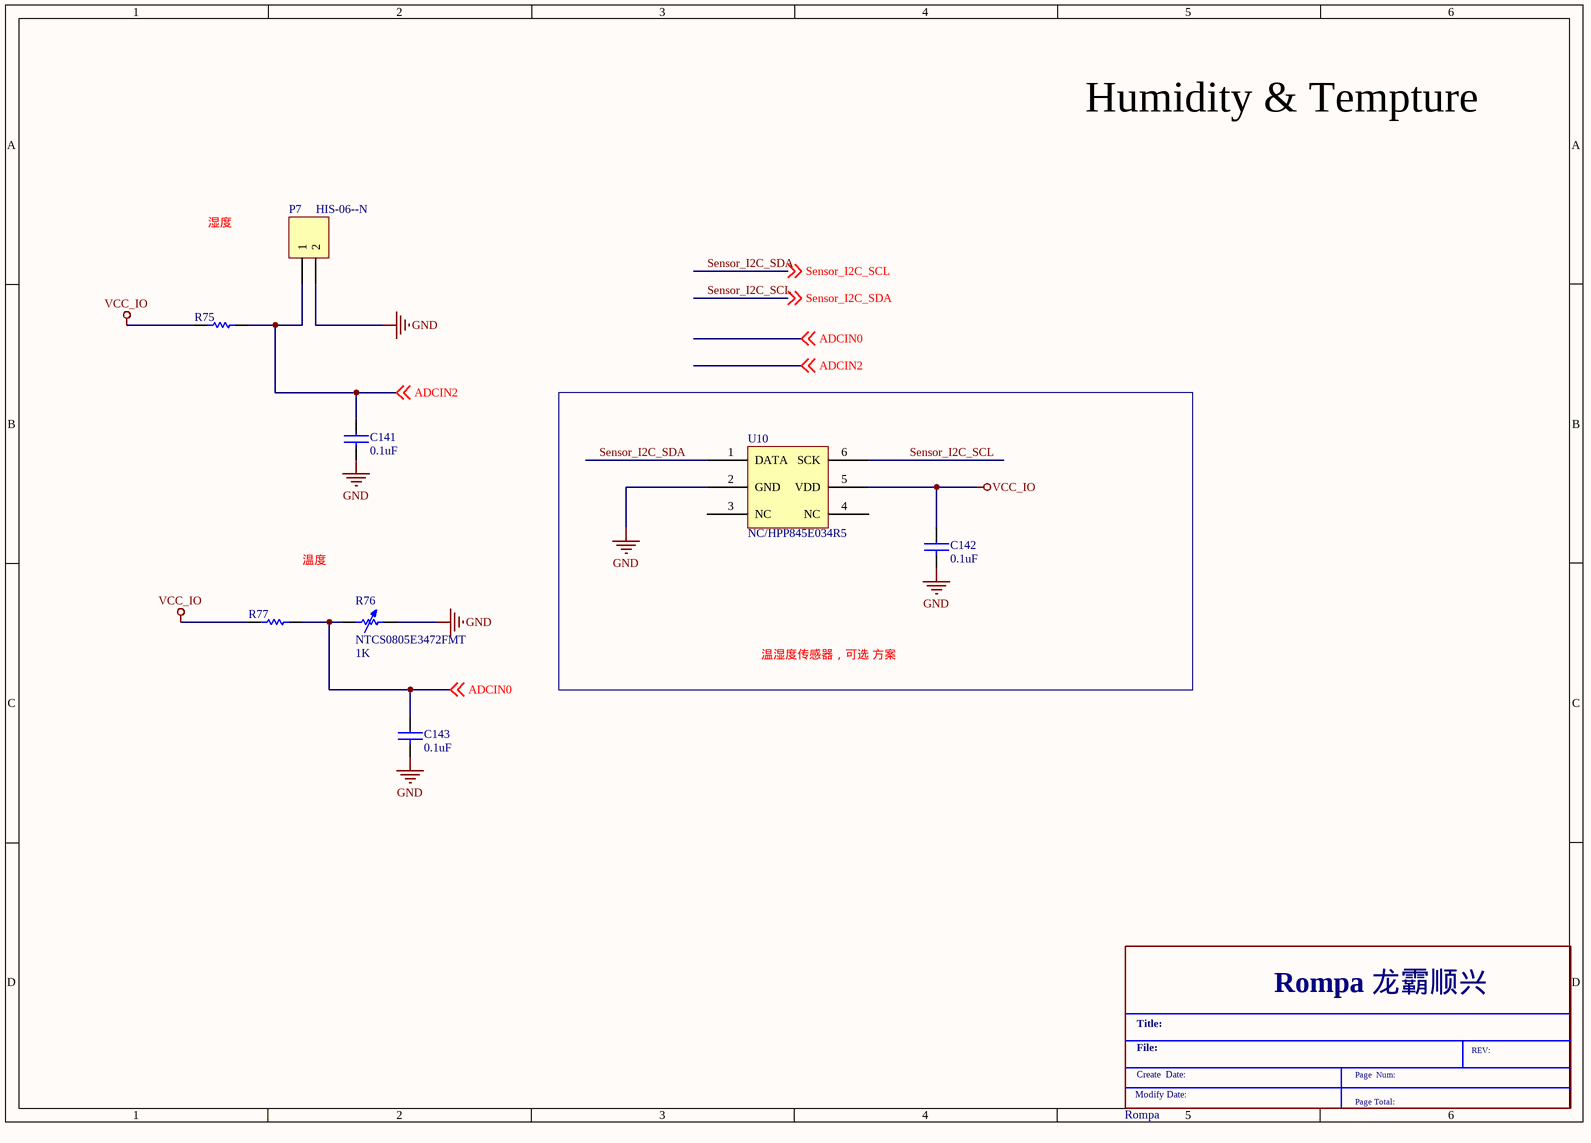
[diagram p13: Option_Humidity_Tempture_Sensor.SchDoc]

### Parts
(Parts that share a designator on the sheet are numbered #1, #2 ... from top to bottom, then left to right.)
*#13  Rompa  (graphical)
C141  0.1uF  [C0402]
C142  0.1uF  [C0402]
C143  0.1uF  [C0402]
P7  HIS-06--N  [HDR1X2]
R75  10K  [0603]  (value not drawn)
R76  NTCS0805E3472FMT  value 1K  [2012[0805]]
R77  10K  [0603]  (value not drawn)
U10  NC/HPP845E034R5

### Blocks framed on the sheet
温湿度传感器，可选 方案: C142 U10

### Nets
GND: C141.2 C142.2 C143.2 P7.2 R76.2 U10.2(GND)
VCC_IO: C142.1 R75.2 R77.2 U10.5(VDD)
ADCIN0: C143.1 R76.1 R77.1 ; off-sheet ADCIN0
ADCIN2: C141.1 P7.1 R75.1 ; off-sheet ADCIN2
Sensor_I2C_SCL: U10.1(DATA) U10.6(SCK) ; off-sheet Sensor_I2C_SDA, off-sheet Sensor_I2C_SCL  [also labelled Sensor_I2C_SDA]  [project net Camera_I2C_SCL]

Not connected (* = marked no-connect by the designer): U10 3(NC) 4(NC)

### Notes on the sheet
- Humidity & Tempture
- 湿度
- 温度
- (in symbol Rompa) Rompa 龙霸顺兴; Title:; File:; REV:; Create  Date:; Page  Num:; Modify Date:; Page Total:

### Library data of the parts
C141-C143 = CAP NP
P7 = Header 2: Humidity Resistor; LatestRevisionDate: 17-Jul-2002; LatestRevisionNote: Re-released for DXP Platform.; Publisher: Altium Limited
R75 R77 = Res1: Resistor; Published: 8-Jun-2000; LatestRevisionDate: 17-Jul-2002; LatestRevisionNote: Re-released for DXP Platform.; PackageReference: AXIAL-0.3; Publisher: Altium Limited; Value: 10K
R76 = Res Adj1: 4K7 NTC 1%; Set Position: 0.5; Published: 8-Jun-2000; LatestRevisionDate: 17-Jul-2002; LatestRevisionNote: Re-released for DXP Platform.; PackageReference: AXIAL-0.7; Publisher: Altium Limited
U10 = HPP845E034R5

## Sheet Option_MotionSensor.SchDoc
size 297 x 209 mm
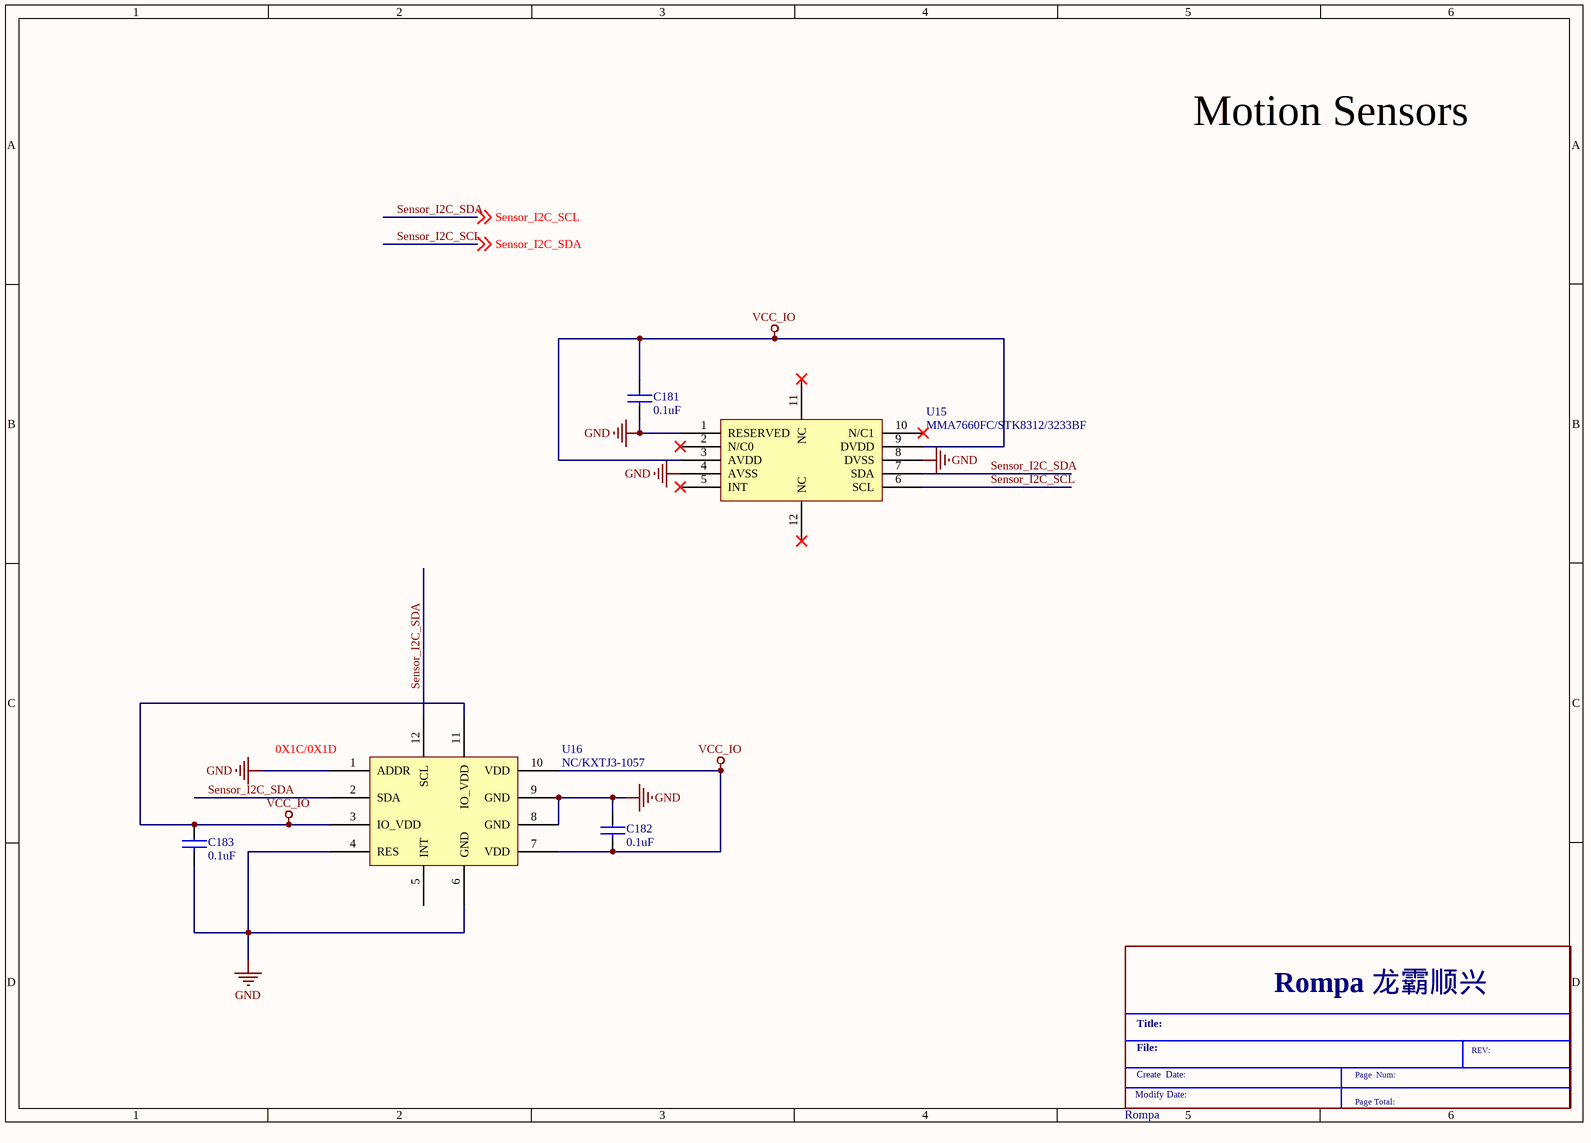
[diagram p14: Option_MotionSensor.SchDoc]

### Parts
(Parts that share a designator on the sheet are numbered #1, #2 ... from top to bottom, then left to right.)
*#14  Rompa  (graphical)
C181  0.1uF  [C0402]
C182  0.1uF  [C0402]
C183  0.1uF  [C0402]
U15  MMA7660FC/STK8312/3233BF
U16  NC/KXTJ3-1057

### Nets
GND: C181.2 C182.1 C183.2 U15.1(RESERVED) U15.4(AVSS) U15.8(DVSS) U16.1(ADDR) U16.4(RES) U16.6(GND) U16.8(GND) U16.9(GND)
VCC_IO: C181.1 C182.2 C183.1 U15.3(AVDD) U15.9(DVDD) U16.3(IO_VDD) U16.7(VDD) U16.10(VDD) U16.11(IO_VDD)
Sensor_I2C_SCL: U15.6(SCL) U15.7(SDA) U16.2(SDA) U16.12(SCL) ; off-sheet Sensor_I2C_SDA, off-sheet Sensor_I2C_SCL  [also labelled Sensor_I2C_SDA]  [project net Camera_I2C_SCL]

Not connected (* = marked no-connect by the designer): U15 2(N/C0)* 5(INT)* 10(N/C1)* 11(NC)* 12(NC)*; U16 5(INT)

### Notes on the sheet
- Motion Sensors
- (near U16) 0X1C/0X1D
- (in symbol Rompa) Rompa 龙霸顺兴; Title:; File:; REV:; Create  Date:; Page  Num:; Modify Date:; Page Total:

### Library data of the parts
C181-C183 = CAP NP
U15 = MMA7660FC
U16 = KXTJ3